# Altium project SR-BMS-Master-Ver1-RevB_stm32f105.PrjPcb
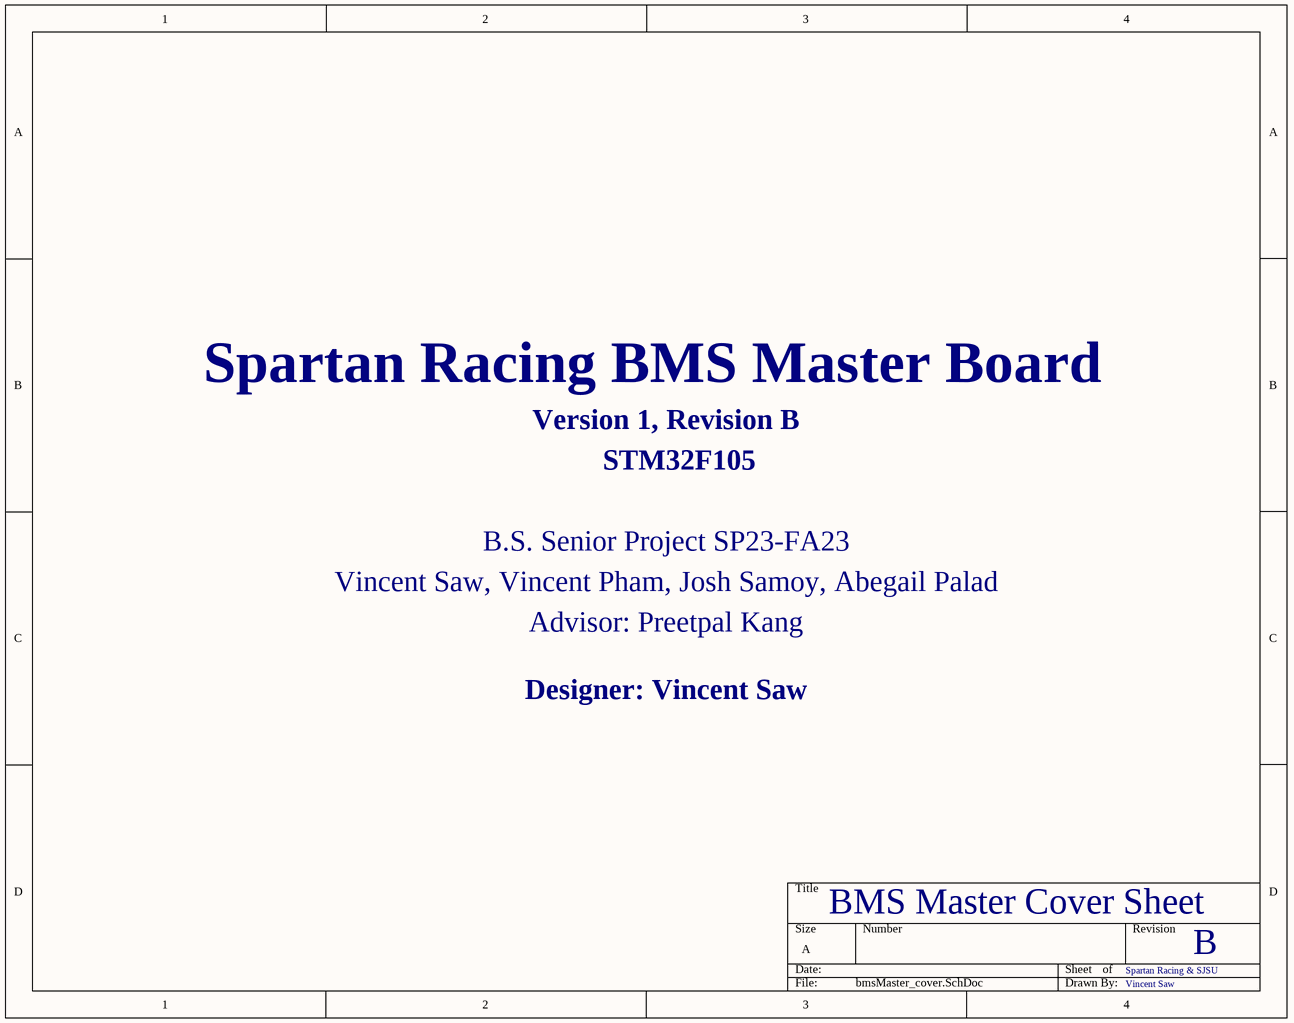
[diagram p0: bmsMaster_cover.SchDoc]
9 sheets, 220 parts. Net scope: global (net labels, ports and power ports of the same name join across sheets).
Board file: bmsMaster.PcbDoc
Sheets:
  bmsMaster_cover.SchDoc
  bmsMaster_main.SchDoc
  bmsMaster_conn.SchDoc
  bmsMaster_lvpower.SchDoc
  bmsMaster_hvpath.SchDoc
  bmsMaster_usb.SchDoc
  bmsMaster_isospi.SchDoc
  bmsMaster_can.SchDoc
  bmsMaster_led.SchDoc

## Sheet bmsMaster_cover.SchDoc
size A; SheetNumber: 1; SheetTotal: 9

### Notes on the sheet
- Spartan Racing BMS Master Board
- Version 1, Revision B
- STM32F105
- B.S. Senior Project SP23-FA23
- Vincent Saw, Vincent Pham, Josh Samoy, Abegail Palad
- Advisor: Preetpal Kang
- Designer: Vincent Saw
- BMS Master Cover Sheet
- Spartan Racing & SJSU
- B
- Vincent Saw

## Sheet bmsMaster_main.SchDoc
size B; SheetNumber: 2; SheetTotal: 9
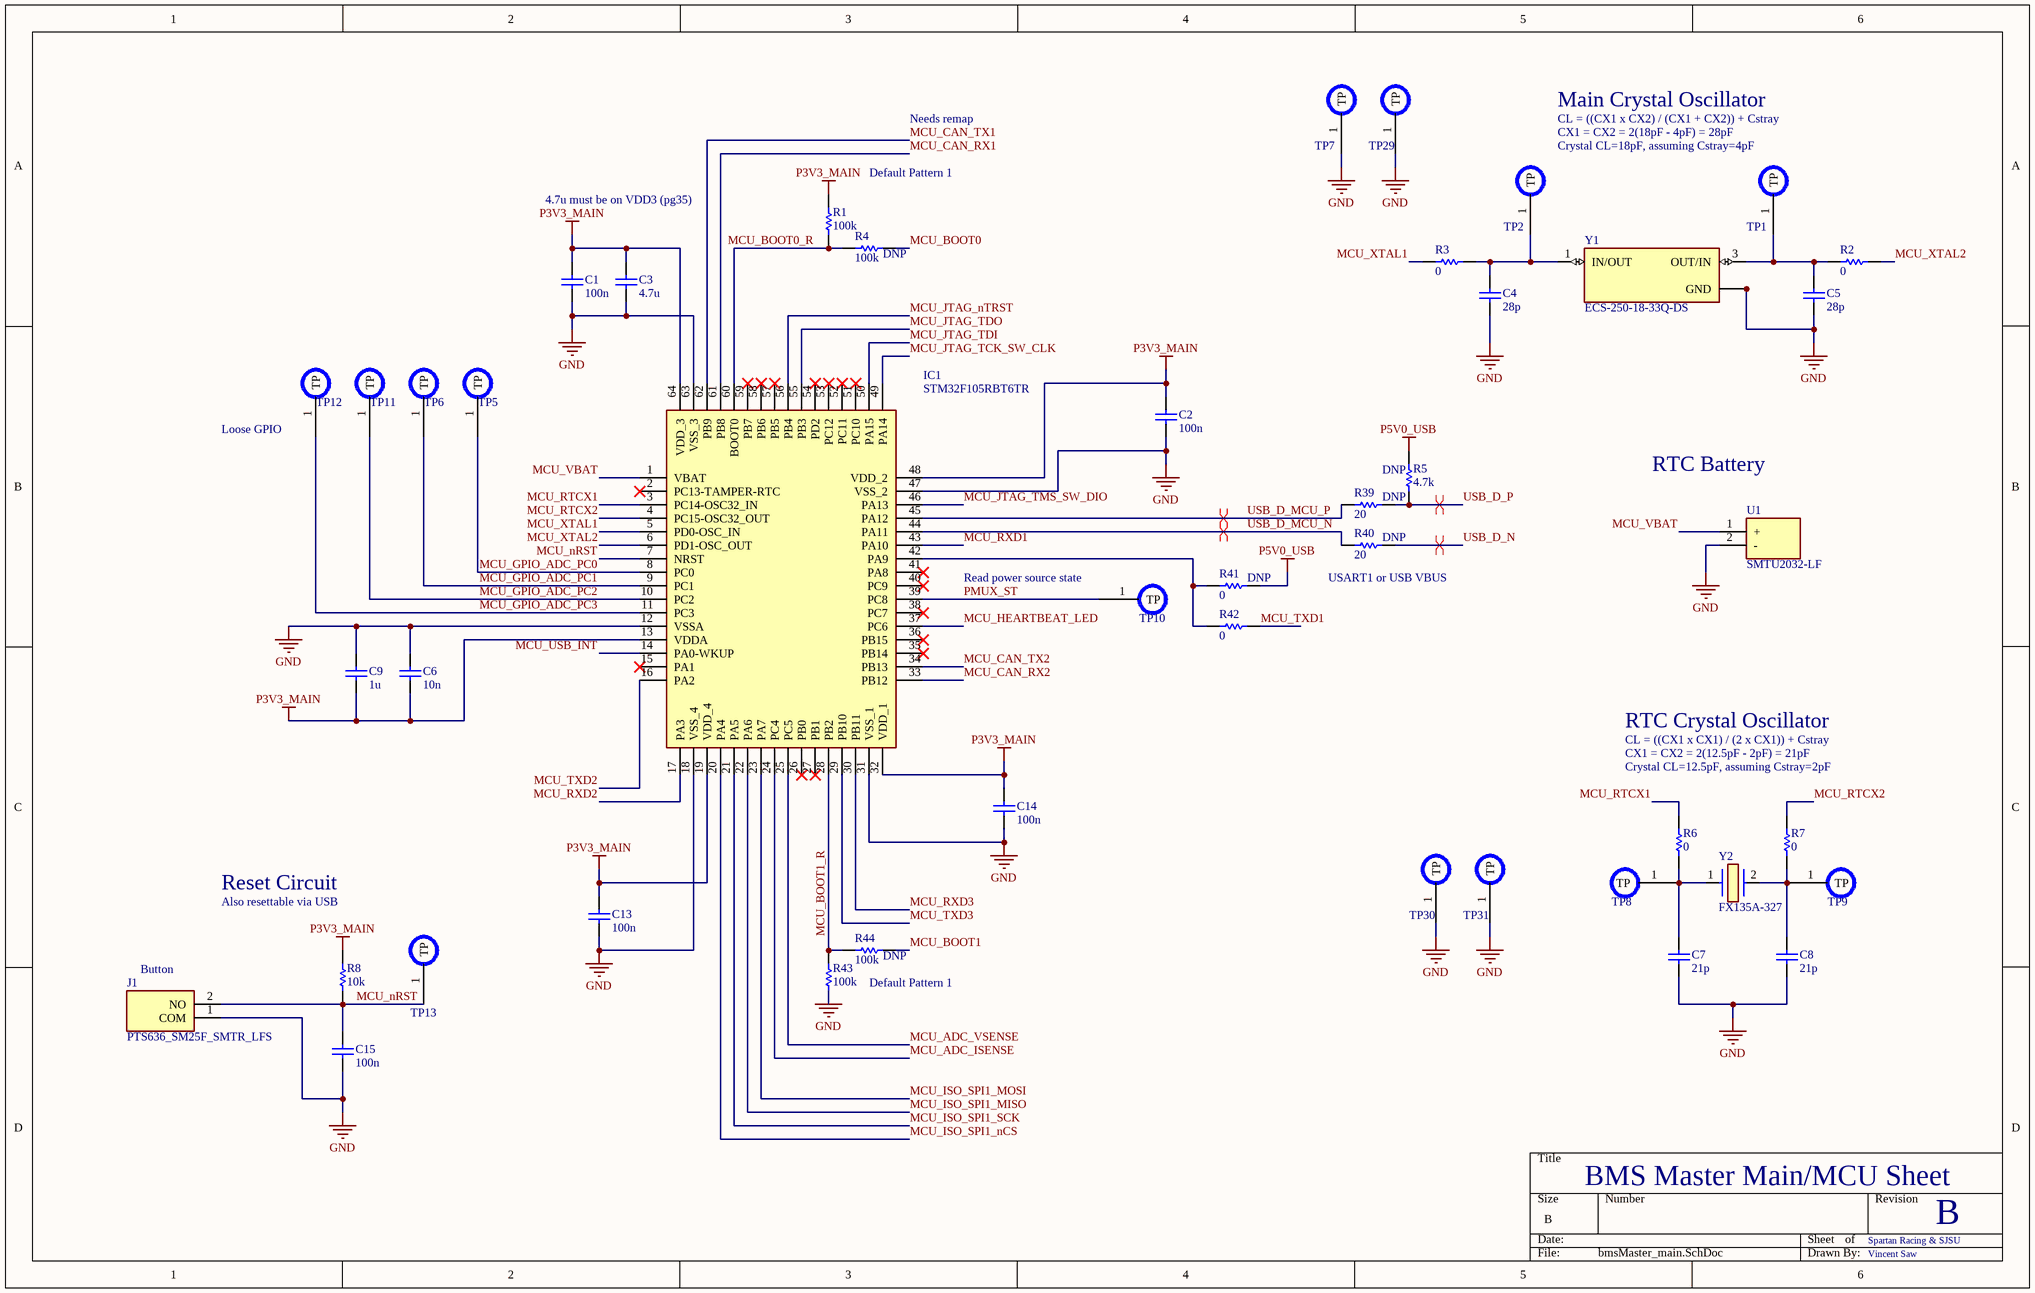
[diagram p1: bmsMaster_main.SchDoc]

### Parts
C1  value 100n  [CAPC1608X90N]  (hidden comment: Capacitor)
C2  value 100n  [CAPC1608X90N]  (hidden comment: Capacitor)
C3  value 4.7u  [CAPC1608X90N]  (hidden comment: Capacitor)
C4  value 28p  [CAPC1608X90N]  (hidden comment: Capacitor)
C5  value 28p  [CAPC1608X90N]  (hidden comment: Capacitor)
C6  value 10n  [CAPC1608X90N]  (hidden comment: Capacitor)
C7  value 21p  [CAPC1608X90N]  (hidden comment: Capacitor)
C8  value 21p  [CAPC1608X90N]  (hidden comment: Capacitor)
C9  value 1u  [CAPC1608X90N]  (hidden comment: Capacitor)
C13  value 100n  [CAPC1608X90N]  (hidden comment: Capacitor)
C14  value 100n  [CAPC1608X90N]  (hidden comment: Capacitor)
C15  value 100n  [CAPC1608X90N]  (hidden comment: Capacitor)
IC1  STM32F105RBT6TR  [QFP50P1200X1200X160-64N]
J1  PTS636_SM25F_SMTR_LFS  [PTS636SM25FSMTRLFS]
R1  value 100k  [RESC1608X50N]  (hidden comment: Resistor)
R2  value 0  [RESC1608X50N]  (hidden comment: Resistor)
R3  value 0  [RESC1608X50N]  (hidden comment: Resistor)
R4  value 100k  [RESC1608X50N]  (hidden comment: Resistor)
R5  value 4.7k  [RESC1608X50N]  (hidden comment: Resistor)
R6  value 0  [RESC1608X50N]  (hidden comment: Resistor)
R7  value 0  [RESC1608X50N]  (hidden comment: Resistor)
R8  value 10k  [RESC1608X50N]  (hidden comment: Resistor)
R39  value 20  [RESC1608X50N]  (hidden comment: Resistor)
R40  value 20  [RESC1608X50N]  (hidden comment: Resistor)
R41  value 0  [RESC1608X50N]  (hidden comment: Resistor)
R42  value 0  [RESC1608X50N]  (hidden comment: Resistor)
R43  value 100k  [RESC1608X50N]  (hidden comment: Resistor)
R44  value 100k  [RESC1608X50N]  (hidden comment: Resistor)
TP1  TSTPT  [Testpoint1]  (value not drawn)  (no BOM)
TP2  TSTPT  [Testpoint1]  (value not drawn)  (no BOM)
TP5  TSTPT  [Testpoint1]  (value not drawn)  (no BOM)
TP6  TSTPT  [Testpoint1]  (value not drawn)  (no BOM)
TP7  TSTPT  [Testpoint1]  (value not drawn)  (no BOM)
TP8  TSTPT  [Testpoint1]  (value not drawn)  (no BOM)
TP9  TSTPT  [Testpoint1]  (value not drawn)  (no BOM)
TP10  TSTPT  [Testpoint1]  (value not drawn)  (no BOM)
TP11  TSTPT  [Testpoint1]  (value not drawn)  (no BOM)
TP12  TSTPT  [Testpoint1]  (value not drawn)  (no BOM)
TP13  TSTPT  [Testpoint1]  (value not drawn)  (no BOM)
TP29  TSTPT  [Testpoint1]  (value not drawn)  (no BOM)
TP30  TSTPT  [Testpoint1]  (value not drawn)  (no BOM)
TP31  TSTPT  [Testpoint1]  (value not drawn)  (no BOM)
U1  SMTU2032-LF  [SMTU2032LF]
Y1  ECS-250-18-33Q-DS  [XTAL_ECS-250-18-33Q-DS]
Y2  FX135A-327  [FX135A327]

### Nets
GND: C1.1 C2.1 C3.1 C4.1 C5.1 C6.2 C7.1 C8.1 C9.2 C13.1 C14.1 C15.1 IC1.12(VSSA) IC1.18(VSS_4) IC1.31(VSS_1) IC1.47(VSS_2) IC1.63(VSS_3) J1.1(COM) R43.2 TP7.1(TP) TP29.1(TP) TP30.1(TP) TP31.1(TP) U1.2(-) Y1.2(GND) Y1.4(GND)
P3V3_MAIN: C1.2 C2.2 C3.2 C6.1 C9.1 C13.2 C14.2 IC1.13(VDDA) IC1.19(VDD_4) IC1.32(VDD_1) IC1.48(VDD_2) IC1.64(VDD_3) R1.2 R8.2
P5V0_USB: R5.2 R41.2
MCU_ADC_ISENSE: IC1.24(PC4)
MCU_ADC_VSENSE: IC1.25(PC5)
MCU_BOOT0: R4.2
MCU_BOOT0_R: IC1.60(BOOT0) R1.1 R4.1
MCU_BOOT1: R44.1
MCU_BOOT1_R: IC1.28(PB2) R43.1 R44.2
MCU_CAN_RX1: IC1.61(PB8)
MCU_CAN_RX2: IC1.33(PB12)
MCU_CAN_TX1: IC1.62(PB9)
MCU_CAN_TX2: IC1.34(PB13)
MCU_GPIO_ADC_PC0: IC1.8(PC0) TP5.1(TP)
MCU_GPIO_ADC_PC1: IC1.9(PC1) TP6.1(TP)
MCU_GPIO_ADC_PC2: IC1.10(PC2) TP11.1(TP)
MCU_GPIO_ADC_PC3: IC1.11(PC3) TP12.1(TP)
MCU_HEARTBEAT_LED: IC1.37(PC6)
MCU_ISO_SPI1_MISO: IC1.22(PA6)
MCU_ISO_SPI1_MOSI: IC1.23(PA7)
MCU_ISO_SPI1_nCS: IC1.20(PA4)
MCU_ISO_SPI1_SCK: IC1.21(PA5)
MCU_JTAG_nTRST: IC1.56(PB4)
MCU_JTAG_TCK_SW_CLK: IC1.49(PA14)
MCU_JTAG_TDI: IC1.50(PA15)
MCU_JTAG_TDO: IC1.55(PB3)
MCU_JTAG_TMS_SW_DIO: IC1.46(PA13)
MCU_nRST: C15.2 IC1.7(NRST) J1.2(NO) R8.1 TP13.1(TP)
MCU_RTCX1: IC1.3(PC14-OSC32_IN) R6.1
MCU_RTCX2: IC1.4(PC15-OSC32_OUT) R7.1
MCU_RXD1: IC1.43(PA10)
MCU_RXD2: IC1.17(PA3)
MCU_RXD3: IC1.30(PB11)
MCU_TXD1: R42.2
MCU_TXD2: IC1.16(PA2)
MCU_TXD3: IC1.29(PB10)
MCU_USB_INT: IC1.14(PA0-WKUP)
MCU_VBAT: IC1.1(VBAT) U1.1(+)
MCU_XTAL1: IC1.5(PD0-OSC_IN) R3.2
MCU_XTAL2: IC1.6(PD1-OSC_OUT) R2.1
PMUX_ST: IC1.39(PC8) TP10.1(TP)
USB_D_MCU_N: IC1.44(PA11) R40.1
USB_D_MCU_P: IC1.45(PA12) R39.1
USB_D_N: R40.2
USB_D_P: R5.1 R39.2
NetC4_2: C4.2 R3.1 TP2.1(TP) Y1.1(IN/OUT)
NetC5_2: C5.2 R2.2 TP1.1(TP) Y1.3(OUT/IN)
NetC7_2: C7.2 R6.2 TP8.1(TP) Y2.1
NetC8_2: C8.2 R7.2 TP9.1(TP) Y2.2
NetIC1_42: IC1.42(PA9) R41.1 R42.1

Not connected (* = marked no-connect by the designer): IC1 2(PC13-TAMPER-RTC)* 15(PA1)* 26(PB0)* 27(PB1)* 35(PB14)* 36(PB15)* 38(PC7)* 40(PC9)* 41(PA8)* 51(PC10)* 52(PC11)* 53(PC12)* 54(PD2)* 57(PB5)* 58(PB6)* 59(PB7)*

### Layout directives
differential pair: USB_D_MCU_N, USB_D_MCU_P, USB_D_N, USB_D_P

### Notes on the sheet
- Needs remap
- Main Crystal Oscillator
- CL = ((CX1 x CX2) / (CX1 + CX2)) + Cstray
- CX1 = CX2 = 2(18pF - 4pF) = 28pF
- Crystal CL=18pF, assuming Cstray=4pF
- 4.7u must be on VDD3 (pg35)
- Default Pattern 1
- (near R4) DNP
- (near TP12) Loose GPIO
- (near R39) DNP
- (near R5) DNP
- RTC Battery
- (near R40) DNP
- (near TP10) Read power source state
- (near R41) DNP
- (near R40) USART1 or USB VBUS
- RTC Crystal Oscillator
- CL = ((CX1 x CX1) / (2 x CX1)) + Cstray
- CX1 = CX2 = 2(12.5pF - 2pF) = 21pF
- Crystal CL=12.5pF, assuming Cstray=2pF
- Reset Circuit
- Also resettable via USB
- (near J1) Button
- (near R44) DNP
- BMS Master Main/MCU Sheet
- Spartan Racing & SJSU
- B
- Vincent Saw

### Library data of the parts
C1-C9 C13-C15 = Capacitor: SimulationGenericComponent: True
IC1 = STM32F105RBT6TR: Integrated Circuit; Manufacturer_Name: STMicroelectronics; Datasheet Link: http://www.st.com/content/ccc/resource/technical/document/datasheet/e4/f3/1a/89/5a/02/46/ae/CD00220364.pdf/files/CD00220364.pdf/jcr:content/translations/en.CD00220364.pdf; Height: 1.6mm; Manufacturer_Part_Number: STM32F105RBT6TR; Mouser Part Number: 511-STM32F105RBT6TR; Mouser Price/Stock: https://www.mouser.co.uk/ProductDetail/STMicroelectronics/STM32F105RBT6TR?qs=mxm%2FV7p14IMAWwOT6UWhYg%3D%3D; Arrow Part Number: STM32F105RBT6TR; Arrow Price/Stock: https://www.arrow.com/en/products/stm32f105rbt6tr/stmicroelectronics
J1 = PTS636_SM25F_SMTR_LFS: Connector; Manufacturer_Name: C & K COMPONENTS; Manufacturer_Part_Number: PTS636 SM25F SMTR LFS; Datasheet Link: https://ms.componentsearchengine.com/Datasheets/1/PTS636 SM25F SMTR LFS.pdf; Height: 2.7mm; Mouser Part Number: 611-PTS636SM25FSMTRL; Mouser Price/Stock: https://www.mouser.co.uk/ProductDetail/CK/PTS636-SM25F-SMTR-LFS?qs=vLWxofP3U2wcBTQSwfMFOw%3D%3D; Arrow Part Number: PTS636 SM25F SMTR LFS; Arrow Price/Stock: https://www.arrow.com/en/products/pts636-sm25f-smtr-lfs/ck
R1 R4 R5 R8 R39 R40 R43 R44 = Resistor: TC1: 0; SimulationGenericComponent: True; TC2: 0
R2 R3 R6 R7 R41 R42 = Resistor: SimulationGenericComponent: True; TC1: 0; TC2: 0
TP1 TP2 TP5-TP13 TP29-TP31 = Testpoint1
U1 = SMTU2032-LF: Undefined or Miscellaneous; Manufacturer_Name: RENATA; Datasheet Link: https://componentsearchengine.com/Datasheets/1/SMTU2032-LF.pdf; Height: 5mm; Manufacturer_Part_Number: SMTU2032-LF; Mouser Part Number: 614-SMTU2032-LF; Mouser Price/Stock: https://www.mouser.co.uk/ProductDetail/Renata/SMTU2032-LF?qs=r1PAtlylphCLeXbokB9Tog%3D%3D
Y1 = ECS-250-18-33Q-DS: MF: {'manufacturer': u'ECS Inc.'}; Package: None; Price: None; Value: *; MP: ECS-250-18-33Q-DS; Availability: Unavailable
Y2 = FX135A-327: Crystal or Oscillator; Manufacturer_Name: Fox; Datasheet Link: https://componentsearchengine.com/Datasheets/2/FX135A-327.pdf; Height: 0.9mm; Manufacturer_Part_Number: FX135A-327; Mouser Part Number: 559-FX135A-327; Mouser Price/Stock: https://www.mouser.co.uk/ProductDetail/Fox-Abracon/FX135A-327?qs=n5MbhIql%252BRlKJidsig7mKQ%3D%3D

## Sheet bmsMaster_conn.SchDoc
size A; SheetNumber: 3; SheetTotal: 9
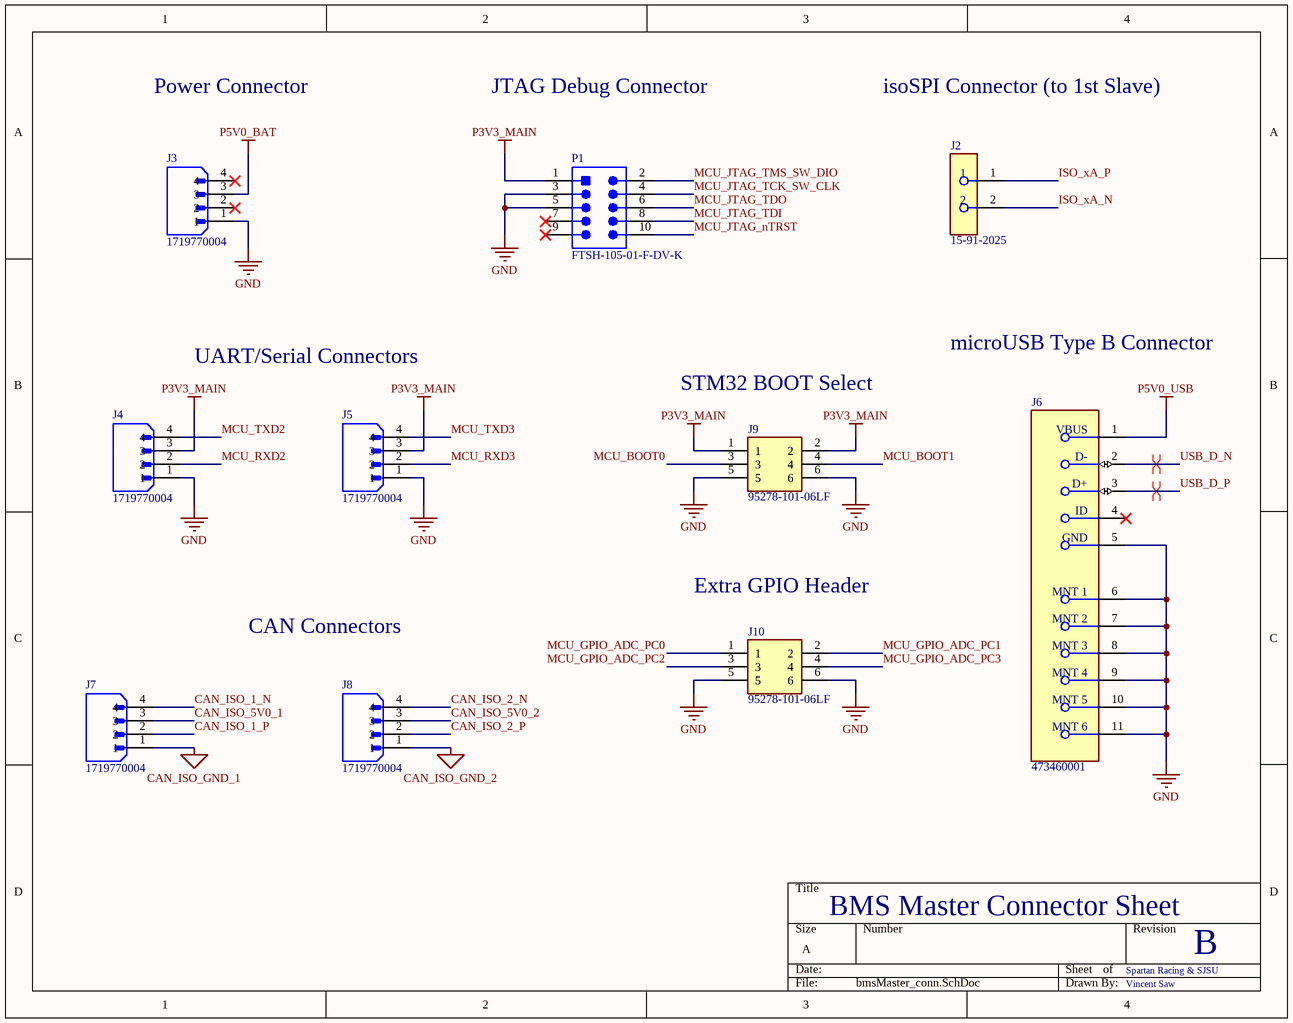
[diagram p2: bmsMaster_conn.SchDoc]

### Parts
J2  15-91-2025  [FP-15-91-2025-MFG]
J3  1719770004  [MOLEX_1719770004]
J4  1719770004  [MOLEX_1719770004]
J5  1719770004  [MOLEX_1719770004]
J6  473460001  [FP-473460001-MFG]
J7  1719770004  [MOLEX_1719770004]
J8  1719770004  [MOLEX_1719770004]
J9  95278-101-06LF  [9527810106LF]
J10  95278-101-06LF  [9527810106LF]
P1  FTSH-105-01-F-DV-K  [SMTC-FTSH-105-01-L-DV-K_V]

### Nets
CAN_ISO_5V0_1: J7.3
CAN_ISO_5V0_2: J8.3
CAN_ISO_GND_1: J7.1
CAN_ISO_GND_2: J8.1
GND: J3.1 J4.1 J5.1 J6.5(GND) J6.6(MNT_1) J6.7(MNT_2) J6.8(MNT_3) J6.9(MNT_4) J6.10(MNT_5) J6.11(MNT_6) J9.5 J9.6 J10.5 J10.6 P1.3 P1.5
P3V3_MAIN: J4.3 J5.3 J9.1 J9.2 P1.1
P5V0_BAT: J3.3
P5V0_USB: J6.1(VBUS)
CAN_ISO_1_N: J7.4
CAN_ISO_1_P: J7.2
CAN_ISO_2_N: J8.4
CAN_ISO_2_P: J8.2
ISO_xA_N: J2.2
ISO_xA_P: J2.1
MCU_BOOT0: J9.3
MCU_BOOT1: J9.4
MCU_GPIO_ADC_PC0: J10.1
MCU_GPIO_ADC_PC1: J10.2
MCU_GPIO_ADC_PC2: J10.3
MCU_GPIO_ADC_PC3: J10.4
MCU_JTAG_nTRST: P1.10
MCU_JTAG_TCK_SW_CLK: P1.4
MCU_JTAG_TDI: P1.8
MCU_JTAG_TDO: P1.6
MCU_JTAG_TMS_SW_DIO: P1.2
MCU_RXD2: J4.2
MCU_RXD3: J5.2
MCU_TXD2: J4.4
MCU_TXD3: J5.4
USB_D_N: J6.2(D-)
USB_D_P: J6.3(D+)

Not connected (* = marked no-connect by the designer): J3 2* 4*; J6 4(ID)*; P1 7* 9*

### Layout directives
differential pair: USB_D_N, USB_D_P

### Notes on the sheet
- Power Connector
- JTAG Debug Connector
- isoSPI Connector (to 1st Slave)
- UART/Serial Connectors
- microUSB Type B Connector
- STM32 BOOT Select
- CAN Connectors
- Extra GPIO Header
- BMS Master Connector Sheet
- Spartan Racing & SJSU
- B
- Vincent Saw

### Library data of the parts
J2 = CMP-04776-000618-1: CONN HEADER SMD R/A 2POS 2.54MM; Number of Contacts: 2; Voltage Rating: 250V; Max Current Rating: 1.75A; Contact Resistance: 30mR; Current Rating: 3A; Insulation Resistance: 1GR; Gender: Male; Glow Wire Compliant: Non-compliant; Contact Mating Length: 0.24inch; Max Operating Temperature: 105°C; Length: 8.64mm; Color: Black; REACH SVHC: No SVHC; Depth: 13.59mm; ELV: Compliant; Material: Brass; Contact Type: Male Pin; Number of Rows: 1; Number of Positions: 2; Housing Color: Black; Pitch: 2.54mm; Housing Material: Polyester; Flammability Rating: UL94 V-0; Packaging: Rail/Tube; RoHS Compliant: Yes; Radiation Hardening: No; Min Operating Temperature: -40°C; Termination: Solder; Mount: Surface Mount; Contact Plating: Gold; Package Quantity: 1830; Height: 5.56mm; Contact Material: Bronze; Orientation: Right Angle; Number of Circuits: 2; Lead Free: Contains Lead; Voltage Rating (DC): 250V; Series: C-Grid® SL™ 70634; Contact Gender: Male
J3-J5 J7 J8 = 1719770004: 2.54mm Pitch SL Header, Single Row, Right-Angle, LCP, Shrouded, Surface Mount, with Pegs, Matte Tin (Sn) Plating, 4 Circuits, Tube; MF: {'manufacturer': u'Molex'}; Price: None; Value: *; MP: 1719770004; Package: None; Availability: Unavailable
J6 = CMP-2000-05246-2: CONN RCPT USB2.0 MICRO B SMD R/A; Manufacturer: Molex; Conn Orientation: Right Angle; Is Female: yes; Shielding: true; Pitch: 0.65mm; Number Of Contacts: 5; Voltage Rating: 30V; Current Rating: 1.8A; Device Class L2: USB Connectors; Digikey Description: CONN RCPT USB2.0 MICRO B SMD R/A; Height: 2.945mm; RoHS: TRUE; ComponentLink2Description: Datasheet; Octopart: https://octopart.com/47346-0001-molex-7164928; Automotive: No; Package: 0; Category: Conn; Device Class L1: Connectors; Usb Standard: USB 2.0; Temperature: -30°C to +85°C; Temperature Range Low: -30°C; Footprint Url: https://www.molex.com/pdm_docs/sd/473460001_sd.pdf; ComponentLink2URL: https://www.molex.com/webdocs/datasheets/pdf/en-us/0473460001_IO_CONNECTORS.pdf; Lead Free: Yes; Manufacturer Part Number: 473460001; Contact Material: Gold,Nickel; Temperature Range High: +85°C; Device Class L3: unset
J9 J10 = 95278-101-06LF: Connector; Manufacturer_Name: Amphenol Communications Solutions; Datasheet Link: https://cdn.amphenol-cs.com/media/wysiwyg/files/drawing/95278.pdf; Height: 10mm; Manufacturer_Part_Number: 95278-101-06LF; Mouser Part Number: 649-95278-101-06LF; Mouser Price/Stock: https://www.mouser.co.uk/ProductDetail/Amphenol-FCI/95278-101-06LF?qs=AwD%252BQufC0y4QEj1gyZtDug%3D%3D; Arrow Part Number: 95278-101-06LF; Arrow Price/Stock: https://www.arrow.com/en/products/95278-101-06lf/amphenol-fci?region=europe
P1 = CMP-2000-05352-1: Male Header, Pitch 1.27 mm, 2 x 5 Position, Height 6.12 mm, RoHS, Tube; Manufacturer: Samtec; Number of Positions: 10; Connector Type: Header,Shrouded; Number of Positions Loaded: All; Row Spacing: 0.050"(1.27mm); Fastening Type: -; Package Reference: FTSH-105-01-L-DV-K; Termination: Solder; Package URL: http://suddendocs.samtec.com/prints/ftsh-1xx-xx-xxx-dv-xxx-footprint.pdf; Number of Rows: 2; Contact Finish Thickness: 3µin(0.08µm); Contact Type: MalePin; Manufacturer URL: http://www.samtec.com/; Contact Mating Length: 0.120"(3.05mm); Pitch: 0.050"(1.27mm); Series: FTSH; Features: -; Contact Finish: Gold; Color: Black; Family: RectangularConnectors-Headers,MalePins; Datasheet URL: http://suddendocs.samtec.com/prints/ftsh-1xx-xx-xxx-dv-xxx-mkt.pdf; Package Description: Male Header, Pitch 1.27 mm, 2 x 5 Position, Height 5.97 mm, Tail Length 4.32 mm; Mounting Type: SurfaceMount; Datasheet Version: Rev. ET, 10/1995; Category: Connectors,Interconnects; Packaging: Tube

## Sheet bmsMaster_lvpower.SchDoc
size A; SheetNumber: 4; SheetTotal: 9
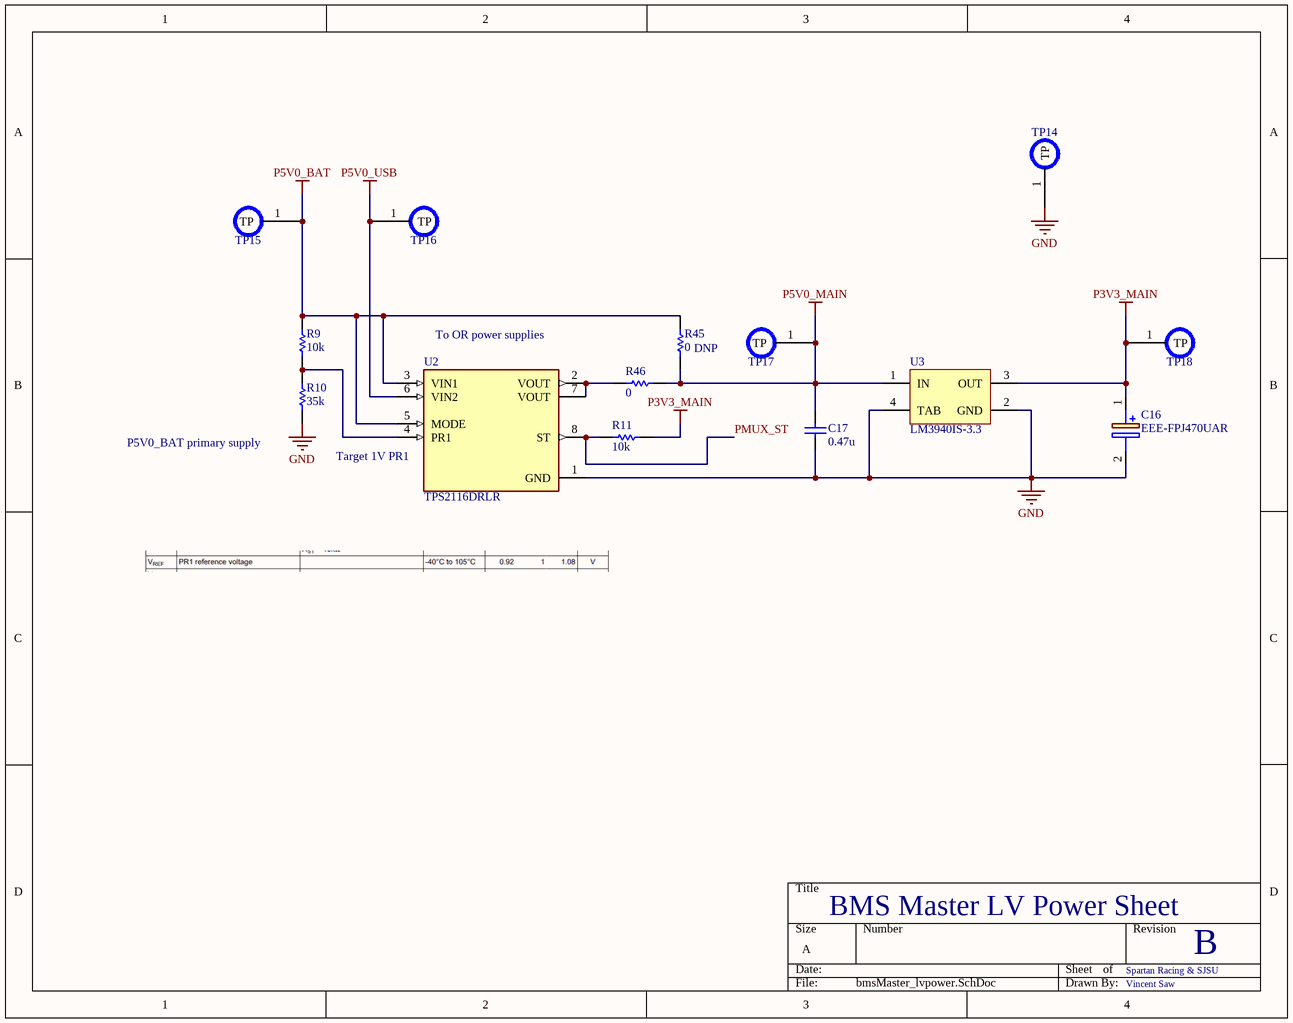
[diagram p3: bmsMaster_lvpower.SchDoc]

### Parts
C16  EEE-FPJ470UAR  [EEE1AA220WR]
C17  value 0.47u  [CAPC1608X90N]  (hidden comment: Capacitor)
R9  value 10k  [RESC1608X50N]  (hidden comment: Resistor)
R10  value 35k  [RESC1608X50N]  (hidden comment: Resistor)
R11  value 10k  [RESC1608X50N]  (hidden comment: Resistor)
R45  value 0  [RESC1608X50N]  (hidden comment: Resistor)
R46  value 0  [RESC1608X50N]  (hidden comment: Resistor)
TP14  TSTPT  [Testpoint1]  (value not drawn)  (no BOM)
TP15  TSTPT  [Testpoint1]  (value not drawn)  (no BOM)
TP16  TSTPT  [Testpoint1]  (value not drawn)  (no BOM)
TP17  TSTPT  [Testpoint1]  (value not drawn)  (no BOM)
TP18  TSTPT  [Testpoint1]  (value not drawn)  (no BOM)
U2  TPS2116DRLR  [SOTFL50P160X60-8N]
U3  LM3940IS-3.3  [KTT0003B_N]

### Nets
GND: C16.2(-) C17.1 R10.1 TP14.1(TP) U2.1(GND) U3.2(GND) U3.4(TAB)
P3V3_MAIN: C16.1(+) R11.1 TP18.1(TP) U3.3(OUT)
P5V0_BAT: R9.2 R45.2 TP15.1(TP) U2.3(VIN1) U2.5(MODE)
P5V0_MAIN: C17.2 R45.1 R46.2 TP17.1(TP) U3.1(IN)
P5V0_USB: TP16.1(TP) U2.6(VIN2)
PMUX_ST: R11.2 U2.8(ST)
NetR9_1: R9.1 R10.2 U2.4(PR1)
NetR46_1: R46.1 U2.2(VOUT) U2.7(VOUT)

### Notes on the sheet
- (near U2) To OR power supplies
- (near R45) DNP
- (near R10) P5V0_BAT primary supply
- (near U2) Target 1V PR1
- BMS Master LV Power Sheet
- Spartan Racing & SJSU
- B
- Vincent Saw

### Library data of the parts
C16 = EEE-FPJ470UAR: Capacitor Polarised; Manufacturer_Name: Panasonic; Datasheet Link: http://industrial.panasonic.com/cdbs/www-data/pdf/RDE0000/ABA0000C1184.pdf; Height: 5.5mm; Manufacturer_Part_Number: EEE-FPJ470UAR; Mouser Part Number: 667-EEE-FPJ470UAR; Mouser Price/Stock: https://www.mouser.com/Search/Refine.aspx?Keyword=667-EEE-FPJ470UAR
C17 = Capacitor: SimulationGenericComponent: True
R9-R11 = Resistor: TC1: 0; SimulationGenericComponent: True; TC2: 0
R45 R46 = Resistor: SimulationGenericComponent: True; TC1: 0; TC2: 0
TP14-TP18 = Testpoint1
U2 = TPS2116DRLR: 1.6 V to 5.5 V, 2.5-A Low IQ Power Mux with Manual and Priority Switchover; MF: {'manufacturer': u'Texas Instruments'}; Value: *; Price: None; Package: None; Availability: Unavailable; MP: TPS2116DRLR
U3 = CMP-0062-00201-4: 1A Low Dropout Regulator for 5V to 3.3V Conversion, 3-pin TO-263; Manufacturer: Texas Instruments; CompType: LDO IC; PowerWise: N; PackageTopMarking: NSUZXYTTE#*LM3940IS*-3.3 P+; PinCount: 3; Code_JEDEC: MO-169-AA; PackageReference: KTT0003B; ComponentLink1URL: http://www.ti.com/general/docs/lit/getliterature.tsp?genericPartNumber=LM3940&fileType=pdf; RoHS: N; PackageDescription: TO-263, Molded, .400 x .390 x .180in, 3 Lead, .1in Pitch, Surface Mount; ComponentLink1Description: Datasheet URL

## Sheet bmsMaster_hvpath.SchDoc
size B; SheetNumber: 5; SheetTotal: 9
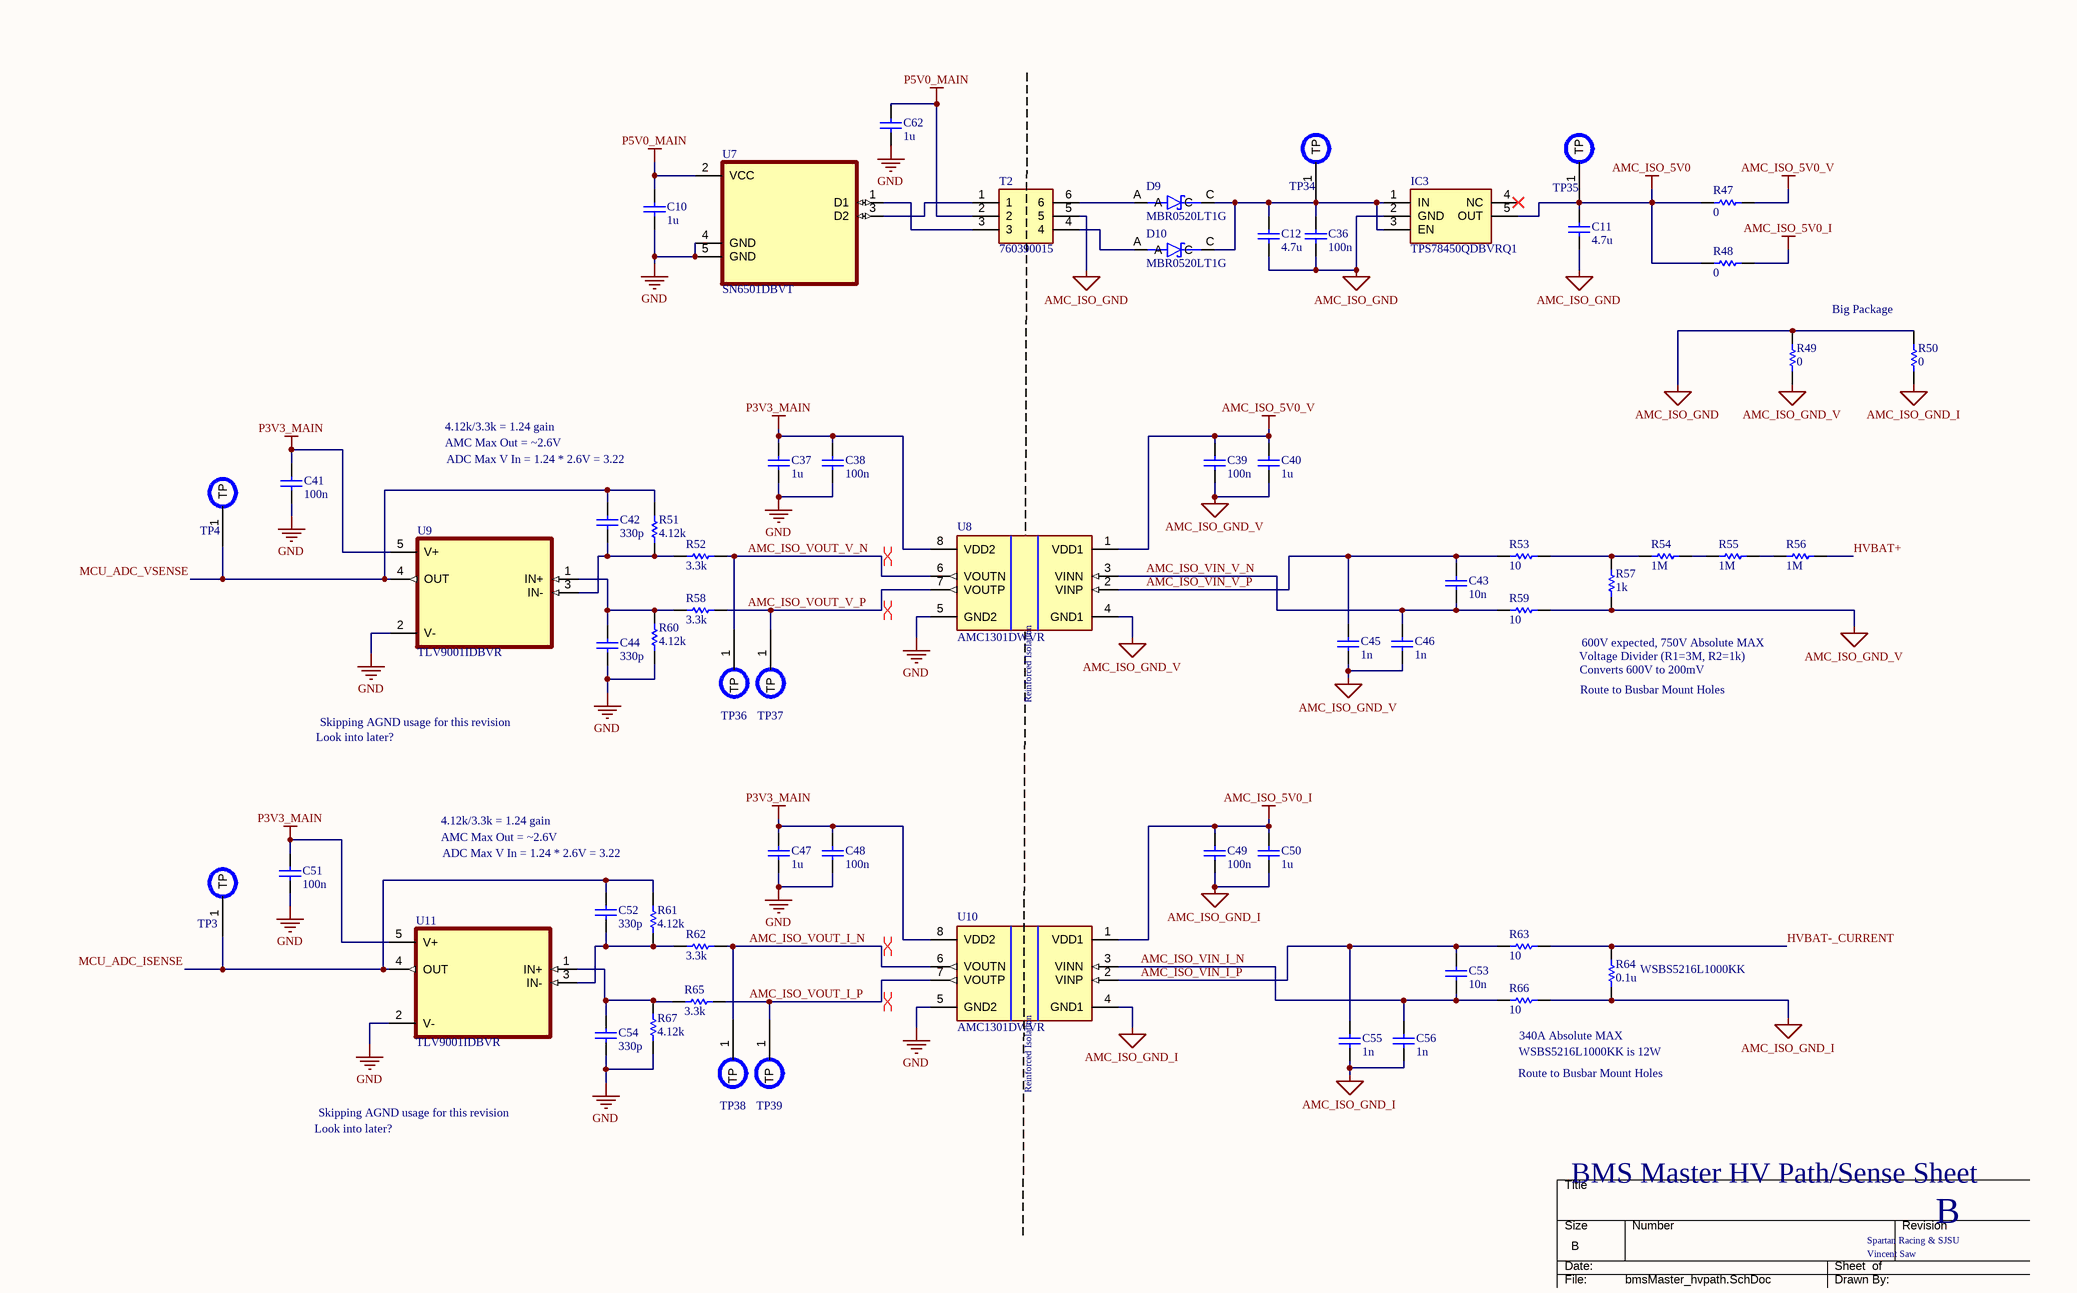
[diagram p4: bmsMaster_hvpath.SchDoc]

### Parts
C10  value 1u  [CAPC1608X90N]  (hidden comment: Capacitor)
C11  value 4.7u  [CAPC1608X90N]  (hidden comment: Capacitor)
C12  value 4.7u  [CAPC1608X90N]  (hidden comment: Capacitor)
C36  value 100n  [CAPC1608X90N]  (hidden comment: Capacitor)
C37  value 1u  [CAPC1608X90N]  (hidden comment: Capacitor)
C38  value 100n  [CAPC1608X90N]  (hidden comment: Capacitor)
C39  value 100n  [CAPC1608X90N]  (hidden comment: Capacitor)
C40  value 1u  [CAPC1608X90N]  (hidden comment: Capacitor)
C41  value 100n  [CAPC1608X90N]  (hidden comment: Capacitor)
C42  value 330p  [CAPC1608X90N]  (hidden comment: Capacitor)
C43  value 10n  [CAPC1608X90N]  (hidden comment: Capacitor)
C44  value 330p  [CAPC1608X90N]  (hidden comment: Capacitor)
C45  value 1n  [CAPC1608X90N]  (hidden comment: Capacitor)
C46  value 1n  [CAPC1608X90N]  (hidden comment: Capacitor)
C47  value 1u  [CAPC1608X90N]  (hidden comment: Capacitor)
C48  value 100n  [CAPC1608X90N]  (hidden comment: Capacitor)
C49  value 100n  [CAPC1608X90N]  (hidden comment: Capacitor)
C50  value 1u  [CAPC1608X90N]  (hidden comment: Capacitor)
C51  value 100n  [CAPC1608X90N]  (hidden comment: Capacitor)
C52  value 330p  [CAPC1608X90N]  (hidden comment: Capacitor)
C53  value 10n  [CAPC1608X90N]  (hidden comment: Capacitor)
C54  value 330p  [CAPC1608X90N]  (hidden comment: Capacitor)
C55  value 1n  [CAPC1608X90N]  (hidden comment: Capacitor)
C56  value 1n  [CAPC1608X90N]  (hidden comment: Capacitor)
C62  value 1u  [CAPC1608X90N]  (hidden comment: Capacitor)
D9  MBR0520LT1G  [SOD3716X135N]
D10  MBR0520LT1G  [SOD3716X135N]
IC3  TPS78450QDBVRQ1  [SOT95P280X145-5N]
R47  value 0  [RESC1608X50N]  (hidden comment: Resistor)
R48  value 0  [RESC1608X50N]  (hidden comment: Resistor)
R49  value 0  [RESC1608X50N]  (hidden comment: Resistor)
R50  value 0  [RESC1608X50N]  (hidden comment: Resistor)
R51  value 4.12k  [RESC1608X50N]  (hidden comment: Resistor)
R52  value 3.3k  [RESC1608X50N]  (hidden comment: Resistor)
R53  value 10  [RESC1608X50N]  (hidden comment: Resistor)
R54  value 1M  [RESC1608X50N]  (hidden comment: Resistor)
R55  value 1M  [RESC1608X50N]  (hidden comment: Resistor)
R56  value 1M  [RESC1608X50N]  (hidden comment: Resistor)
R57  value 1k  [RESC1608X50N]  (hidden comment: Resistor)
R58  value 3.3k  [RESC1608X50N]  (hidden comment: Resistor)
R59  value 10  [RESC1608X50N]  (hidden comment: Resistor)
R60  value 4.12k  [RESC1608X50N]  (hidden comment: Resistor)
R61  value 4.12k  [RESC1608X50N]  (hidden comment: Resistor)
R62  value 3.3k  [RESC1608X50N]  (hidden comment: Resistor)
R63  value 10  [RESC1608X50N]  (hidden comment: Resistor)
R64  WSBS5216L1000KK  value 0.1u  [RESC1608X50N]
R65  value 3.3k  [RESC1608X50N]  (hidden comment: Resistor)
R66  value 10  [RESC1608X50N]  (hidden comment: Resistor)
R67  value 4.12k  [RESC1608X50N]  (hidden comment: Resistor)
T2  760390015  [760390015]
TP3  TSTPT  [Testpoint1]  (value not drawn)  (no BOM)
TP4  TSTPT  [Testpoint1]  (value not drawn)  (no BOM)
TP34  TSTPT  [Testpoint1]  (value not drawn)  (no BOM)
TP35  TSTPT  [Testpoint1]  (value not drawn)  (no BOM)
TP36  TSTPT  [Testpoint1]  (value not drawn)  (no BOM)
TP37  TSTPT  [Testpoint1]  (value not drawn)  (no BOM)
TP38  TSTPT  [Testpoint1]  (value not drawn)  (no BOM)
TP39  TSTPT  [Testpoint1]  (value not drawn)  (no BOM)
U7  SN6501DBVT  [SOT95P280X145-5N]
U8  AMC1301DWVR  [SOIC127P1150X280-8N]
U9  TLV9001IDBVR  [SOT95P280X145-5N]
U10  AMC1301DWVR  [SOIC127P1150X280-8N]
U11  TLV9001IDBVR  [SOT95P280X145-5N]

### Nets
AMC_ISO_5V0: C11.2 IC3.5(OUT) R47.1 R48.1 TP35.1(TP)
AMC_ISO_5V0_I: C49.2 C50.2 R48.2 U10.1(VDD1)
AMC_ISO_5V0_V: C39.2 C40.2 R47.2 U8.1(VDD1)
AMC_ISO_GND: C11.1 C12.1 C36.1 IC3.2(GND) R49.2 R50.2 T2.5
AMC_ISO_GND_I: C49.1 C50.1 C55.1 C56.1 R50.1 R64.1 R66.1 U10.4(GND1)
AMC_ISO_GND_V: C39.1 C40.1 C45.1 C46.1 R49.1 R57.1 R59.1 U8.4(GND1)
GND: C10.1 C37.1 C38.1 C41.1 C44.1 C47.1 C48.1 C51.1 C54.1 C62.1 R60.2 R67.2 U7.4(GND) U7.5(GND) U8.5(GND2) U9.2(V-) U10.5(GND2) U11.2(V-)
P3V3_MAIN: C37.2 C38.2 C41.2 C47.2 C48.2 C51.2 U8.8(VDD2) U9.5(V+) U10.8(VDD2) U11.5(V+)
P5V0_MAIN: C10.2 C62.2 T2.2 U7.2(VCC)
AMC_ISO_VIN_I_N: C53.1 C56.2 R66.2 U10.3(VINN)
AMC_ISO_VIN_I_P: C53.2 C55.2 R63.2 U10.2(VINP)
AMC_ISO_VIN_V_N: C43.1 C46.2 R59.2 U8.3(VINN)
AMC_ISO_VIN_V_P: C43.2 C45.2 R53.2 U8.2(VINP)
AMC_ISO_VOUT_I_N: R62.1 TP38.1(TP) U10.6(VOUTN)
AMC_ISO_VOUT_I_P: R65.1 TP39.1(TP) U10.7(VOUTP)
AMC_ISO_VOUT_V_N: R52.1 TP36.1(TP) U8.6(VOUTN)
AMC_ISO_VOUT_V_P: R58.1 TP37.1(TP) U8.7(VOUTP)
HVBAT+: R56.1
HVBAT-_CURRENT: R63.1 R64.2
MCU_ADC_ISENSE: C52.2 R61.1 TP3.1(TP) U11.4(OUT)
MCU_ADC_VSENSE: C42.2 R51.1 TP4.1(TP) U9.4(OUT)
NetC12_2: C12.2 C36.2 D9.C D10.C IC3.1(IN) IC3.3(EN) TP34.1(TP)
NetC42_1: C42.1 R51.2 R52.2 U9.3(IN-)
NetC44_2: C44.2 R58.2 R60.1 U9.1(IN+)
NetC52_1: C52.1 R61.2 R62.2 U11.3(IN-)
NetC54_2: C54.2 R65.2 R67.1 U11.1(IN+)
NetD9_A: D9.A T2.6
NetD10_A: D10.A T2.4
NetR53_1: R53.1 R54.2 R57.2
NetR54_1: R54.1 R55.2
NetR55_1: R55.1 R56.2
NetT2_1: T2.1 U7.3(D2)
NetT2_3: T2.3 U7.1(D1)

Not connected (* = marked no-connect by the designer): IC3 4(NC)*

### Layout directives
differential pair: AMC_ISO_VOUT_I_N, AMC_ISO_VOUT_I_P, AMC_ISO_VOUT_V_N, AMC_ISO_VOUT_V_P

### Notes on the sheet
- Big Package
- 4.12k/3.3k = 1.24 gain
- AMC Max Out = ~2.6V
- ADC Max V In = 1.24 * 2.6V = 3.22
- Converts 600V to 200mV
- Route to Busbar Mount Holes
- Voltage Divider (R1=3M, R2=1k)
- 600V expected, 750V Absolute MAX
- Look into later?
- Skipping AGND usage for this revision
- 340A Absolute MAX
- WSBS5216L1000KK is 12W
- BMS Master HV Path/Sense Sheet
- Spartan Racing & SJSU
- B
- Vincent Saw
- DWG. NO.
- REV.
- SHT.
- THIS DOCUMENT AND THE DATA DISCLOSED HEREIN OR HEREWITH IS THE PROPERTY OF ALTIUM LIMITED AND MAY BE FREELY DISTRIBUTED IN WHOLE. NO RIGHTS ARE RESERVED OR EXPRESS OR IMPLIED WARANTEE GIVEN.
- REVISION
- DESCRIPTION
- DATE
- APPROVED
- ENG:
- APPROVALS
- PROJECT
- DSN:
- CHK:
- REFERENCE DOCUMENTS
- PROJECT REVISION:
- TITLE
- DOCUMENT REVISION:
- DESIGN ITEM:
- BOM:
- FAB DWG:
- PCB DWG:
- ASSY DWG:
- SCALE:
- SIZE
- CAGE CODE
- FILE NAME
- DWG NO.
- SHEET
- OF
- REV
- (in symbol AMC1301DWVR) Reinforced Isolation

### Library data of the parts
C10-C12 C36-C56 C62 = Capacitor: SimulationGenericComponent: True
D9 D10 = MBR0520LT1G: Rectifier, Schottky Power; Plastic Sod-123; 0.5 a @ +90c If; +125; 20v; 1000; MF: {'manufacturer': u'ON Semiconductor'}; Package: None; Price: None; Value: *; MP: MBR0520LT1G; Availability: Unavailable
IC3 = TPS78450QDBVRQ1: Integrated Circuit; Manufacturer_Name: Texas Instruments; Datasheet Link: https://www.ti.com/lit/ds/symlink/tps784-q1.pdf?ts=1621597556803&ref_url=https%253A%252F%252Fwww.ti.com%252Fstore%252Fti%252Fen%252Fp%252Fproduct%252F%253Fp%253DTPS78401QDBVRQ1; Height: 1.45mm; Manufacturer_Part_Number: TPS78450QDBVRQ1; Mouser Part Number: 595-TPS78450QDBVRQ1; Mouser Price/Stock: https://www.mouser.co.uk/ProductDetail/Texas-Instruments/TPS78450QDBVRQ1?qs=OlC7AqGiEDlNiKKFTXJdtA%3D%3D
R47-R50 = Resistor: SimulationGenericComponent: True; TC1: 0; TC2: 0
R51-R53 R58-R67 = Resistor: TC1: 0; SimulationGenericComponent: True; TC2: 0
R54-R57 = Resistor: WSBS5216L1000KK; TC1: 0; SimulationGenericComponent: True; TC2: 0
T2 = 760390015: Transformer; Manufacturer_Name: Wurth Elektronik; Datasheet Link: https://www.we-online.com/components/products/datasheet/760390015.pdf; Manufacturer_Part_Number: 760390015; Mouser Part Number: 710-760390015; Mouser Price/Stock: https://www.mouser.co.uk/ProductDetail/Wurth-Elektronik/760390015?qs=wElim4iM2pjOQCmk%252B8YbFA%3D%3D
TP3 TP4 TP34-TP39 = Testpoint1
U7 = SN6501DBVT: MF: {'manufacturer': u'Texas Instruments'}; Package: None; Price: None; Value: *; MP: SN6501DBVT; Availability: Unavailable
U8 U10 = AMC1301DWVR: MF: {'manufacturer': u'Texas Instruments'}; Package: None; Price: None; Value: *; MP: AMC1301DWVR; Availability: Unavailable
U9 U11 = TLV9001IDBVR: MF: {'manufacturer': u'Texas Instruments'}; Package: None; Price: None; Value: *; MP: TLV9001IDBVR; Availability: Unavailable

## Sheet bmsMaster_usb.SchDoc
size A; SheetNumber: 6; SheetTotal: 9
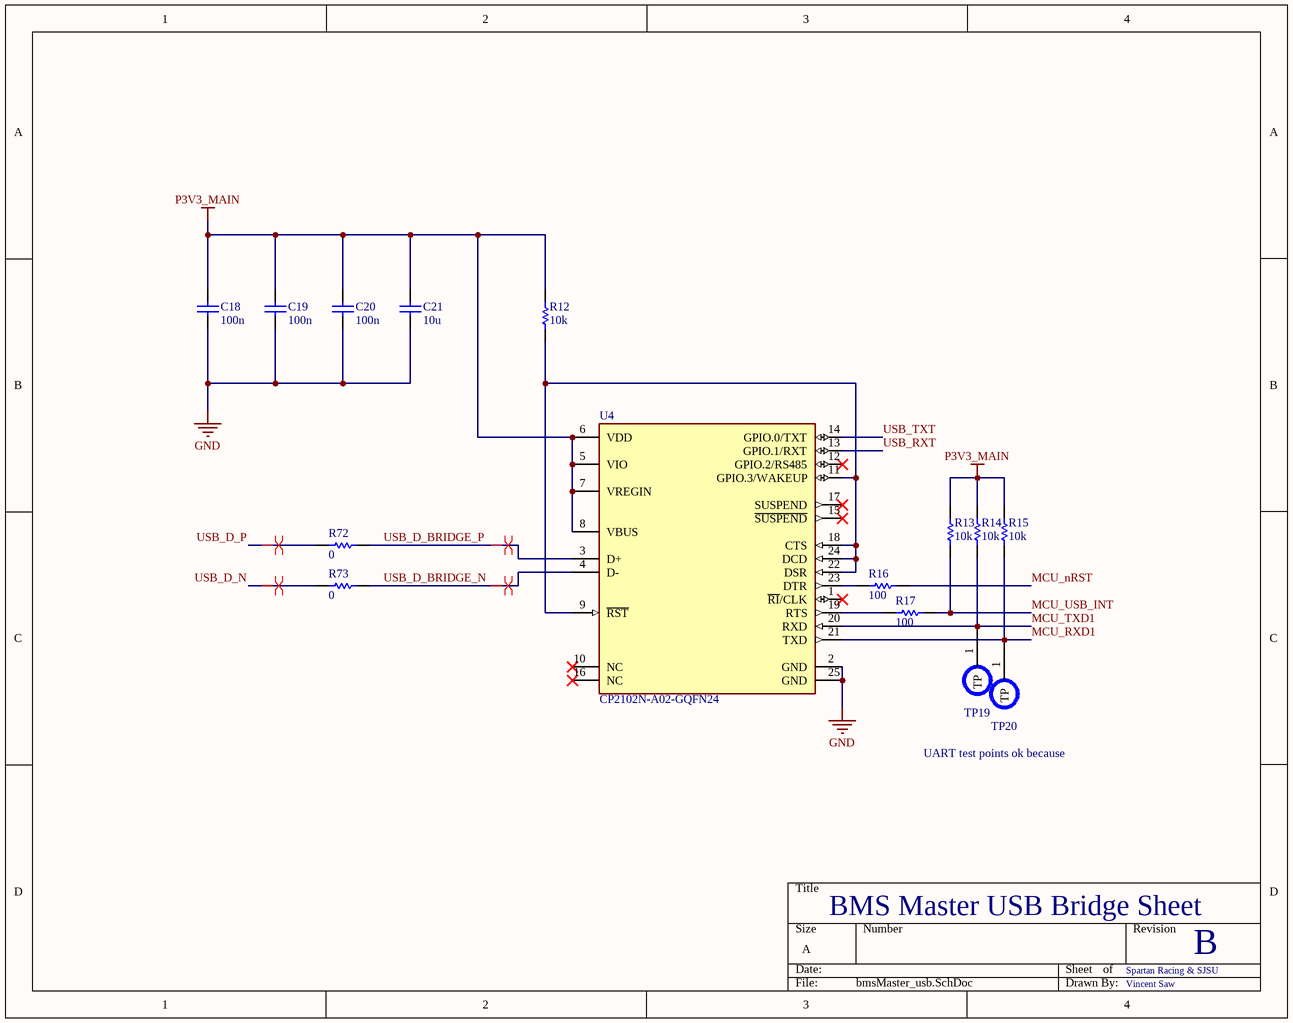
[diagram p5: bmsMaster_usb.SchDoc]

### Parts
C18  value 100n  [CAPC1608X90N]  (hidden comment: Capacitor)
C19  value 100n  [CAPC1608X90N]  (hidden comment: Capacitor)
C20  value 100n  [CAPC1608X90N]  (hidden comment: Capacitor)
C21  value 10u  [CAPC1608X90N]  (hidden comment: Capacitor)
R12  value 10k  [RESC1608X50N]  (hidden comment: Resistor)
R13  value 10k  [RESC1608X50N]  (hidden comment: Resistor)
R14  value 10k  [RESC1608X50N]  (hidden comment: Resistor)
R15  value 10k  [RESC1608X50N]  (hidden comment: Resistor)
R16  value 100  [RESC1608X50N]  (hidden comment: Resistor)
R17  value 100  [RESC1608X50N]  (hidden comment: Resistor)
R72  value 0  [RESC1608X50N]  (hidden comment: Resistor)
R73  value 0  [RESC1608X50N]  (hidden comment: Resistor)
TP19  TSTPT  [Testpoint1]  (value not drawn)  (no BOM)
TP20  TSTPT  [Testpoint1]  (value not drawn)  (no BOM)
U4  CP2102N-A02-GQFN24  [FP-CP2102N-A02-GQFN24-MFG]

### Nets
GND: C18.1 C19.1 C20.1 C21.1 U4.2(GND) U4.25(GND)
P3V3_MAIN: C18.2 C19.2 C20.2 C21.2 R12.2 R13.2 R14.2 R15.2 U4.5(VIO) U4.6(VDD) U4.7(VREGIN) U4.8(VBUS)
MCU_nRST: R16.1
MCU_RXD1: R15.1 TP20.1(TP) U4.21(TXD)
MCU_TXD1: R14.1 TP19.1(TP) U4.20(RXD)
MCU_USB_INT: R13.1 R17.1
USB_D_BRIDGE_N: R73.2 U4.4(D-)
USB_D_BRIDGE_P: R72.2 U4.3(D+)
USB_D_N: R73.1
USB_D_P: R72.1
USB_RXT: U4.13(GPIO.1/RXT)
USB_TXT: U4.14(GPIO.0/TXT)
NetR12_1: R12.1 U4.9(~{RST}) U4.11(GPIO.3/WAKEUP) U4.18(CTS) U4.22(DSR) U4.24(DCD)
NetR16_2: R16.2 U4.23(DTR)
NetR17_2: R17.2 U4.19(RTS)

Not connected (* = marked no-connect by the designer): U4 1(~{RI}/CLK)* 10(NC)* 12(GPIO.2/RS485)* 15(~{SUSPEND})* 16(NC)* 17(SUSPEND)*

### Layout directives
differential pair: USB_D_BRIDGE_N, USB_D_BRIDGE_P, USB_D_N, USB_D_P

### Notes on the sheet
- UART test points ok because
- BMS Master USB Bridge Sheet
- Spartan Racing & SJSU
- B
- Vincent Saw

### Library data of the parts
C18-C21 = Capacitor: SimulationGenericComponent: True
R12-R17 = Resistor: TC1: 0; SimulationGenericComponent: True; TC2: 0
R72 R73 = Resistor: SimulationGenericComponent: True; TC1: 0; TC2: 0
TP19 TP20 = Testpoint1
U4 = CMP-08107-000010-1: IC USB TO UART BRIDGE QFN24

## Sheet bmsMaster_isospi.SchDoc
size A; SheetNumber: 7; SheetTotal: 9
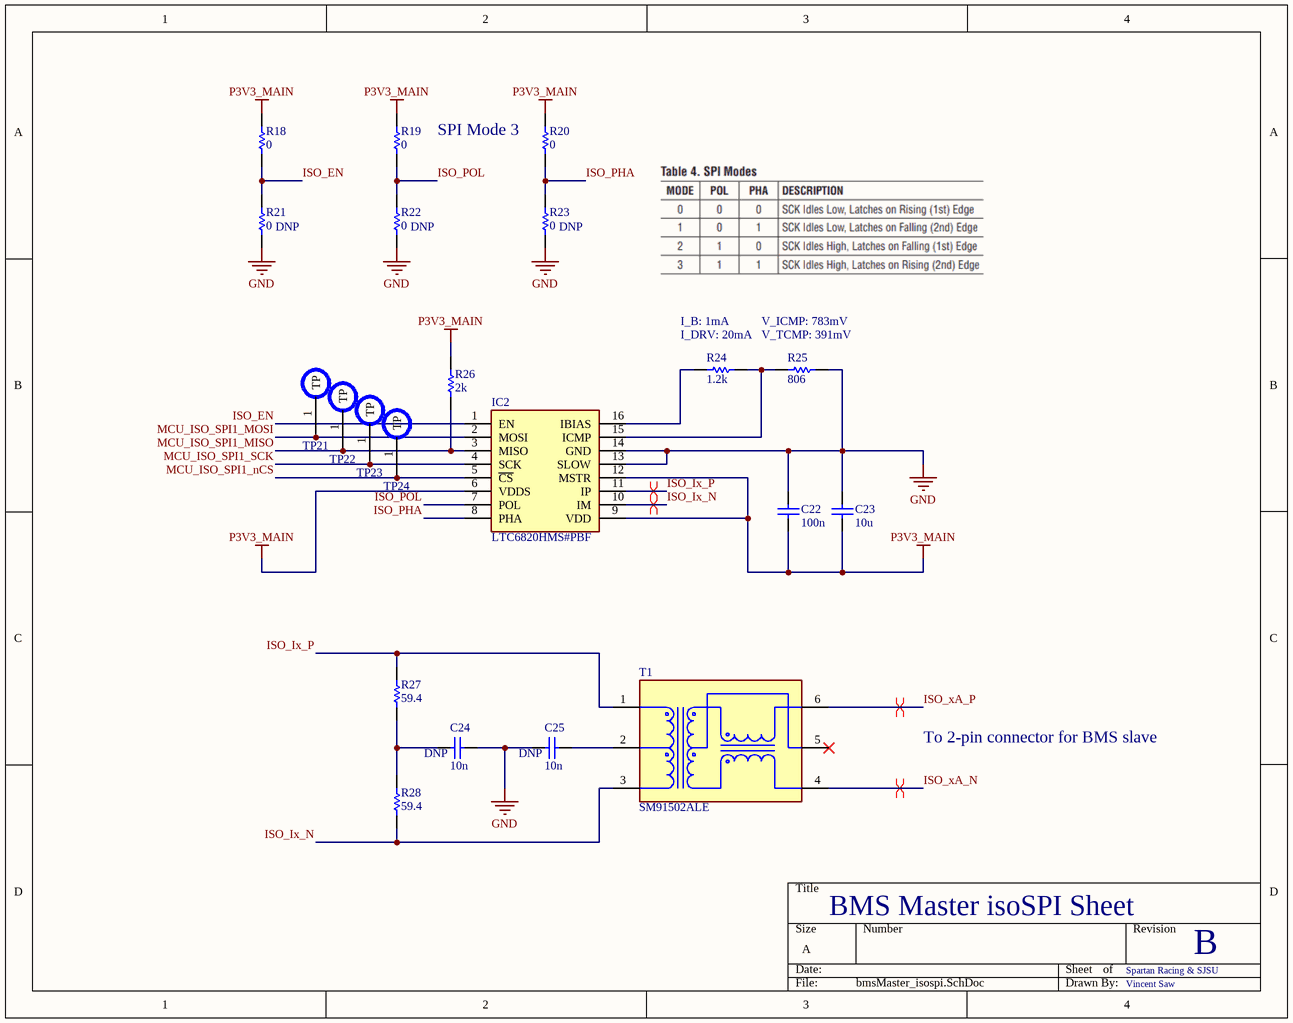
[diagram p6: bmsMaster_isospi.SchDoc]

### Parts
C22  value 100n  [CAPC1608X90N]  (hidden comment: Capacitor)
C23  value 10u  [CAPC1608X90N]  (hidden comment: Capacitor)
C24  value 10n  [CAPC1608X90N]  (hidden comment: Capacitor)
C25  value 10n  [CAPC1608X90N]  (hidden comment: Capacitor)
IC2  LTC6820HMS#PBF  [SOP50P490X110-16N]
R18  value 0  [RESC1608X50N]  (hidden comment: Resistor)
R19  value 0  [RESC1608X50N]  (hidden comment: Resistor)
R20  value 0  [RESC1608X50N]  (hidden comment: Resistor)
R21  value 0  [RESC1608X50N]  (hidden comment: Resistor)
R22  value 0  [RESC1608X50N]  (hidden comment: Resistor)
R23  value 0  [RESC1608X50N]  (hidden comment: Resistor)
R24  value 1.2k  [RESC1608X50N]  (hidden comment: Resistor)
R25  value 806  [RESC1608X50N]  (hidden comment: Resistor)
R26  value 2k  [RESC1608X50N]  (hidden comment: Resistor)
R27  value 59.4  [RESC1608X50N]  (hidden comment: Resistor)
R28  value 59.4  [RESC1608X50N]  (hidden comment: Resistor)
T1  SM91502ALE  [FP-SM91502ALE-MFG]
TP21  TSTPT  [Testpoint1]  (value not drawn)  (no BOM)
TP22  TSTPT  [Testpoint1]  (value not drawn)  (no BOM)
TP23  TSTPT  [Testpoint1]  (value not drawn)  (no BOM)
TP24  TSTPT  [Testpoint1]  (value not drawn)  (no BOM)

### Nets
GND: C22.2 C23.2 C24.1 C25.1 IC2.13(SLOW) IC2.14(GND) R21.1 R22.1 R23.1 R25.2
P3V3_MAIN: C22.1 C23.1 IC2.6(VDDS) IC2.9(VDD) IC2.12(MSTR) R18.2 R19.2 R20.2 R26.2
ISO_EN: IC2.1(EN) R18.1 R21.2
ISO_Ix_N: IC2.10(IM) R28.1 T1.3
ISO_Ix_P: IC2.11(IP) R27.2 T1.1
ISO_PHA: IC2.8(PHA) R20.1 R23.2
ISO_POL: IC2.7(POL) R19.1 R22.2
ISO_xA_N: T1.4
ISO_xA_P: T1.6
MCU_ISO_SPI1_MISO: IC2.3(MISO) R26.1 TP22.1(TP)
MCU_ISO_SPI1_MOSI: IC2.2(MOSI) TP21.1(TP)
MCU_ISO_SPI1_nCS: IC2.5(~{CS}) TP24.1(TP)
MCU_ISO_SPI1_SCK: IC2.4(SCK) TP23.1(TP)
NetC24_2: C24.2 R27.1 R28.2
NetC25_2: C25.2 T1.2
NetIC2_15: IC2.15(ICMP) R24.2 R25.1
NetIC2_16: IC2.16(IBIAS) R24.1

Not connected (* = marked no-connect by the designer): T1 5*

### Layout directives
differential pair: ISO_Ix_N, ISO_Ix_P, ISO_xA_N, ISO_xA_P

### Notes on the sheet
- (near R20) SPI Mode 3
- (near R21) DNP
- (near R22) DNP
- (near R23) DNP
- (near R24) I_B: 1mA
- (near R24) I_DRV: 20mA
- V_ICMP: 783mV
- V_TCMP: 391mV
- (near C24) DNP
- (near C25) DNP
- To 2-pin connector for BMS slave
- BMS Master isoSPI Sheet
- Spartan Racing & SJSU
- B
- Vincent Saw

### Library data of the parts
C22-C25 = Capacitor: SimulationGenericComponent: True
IC2 = LTC6820HMS#PBF: Integrated Circuit; Manufacturer_Name: Analog Devices; Datasheet Link: https://www.analog.com/media/en/technical-documentation/data-sheets/LTC6820.pdf; Height: 1.1mm; Manufacturer_Part_Number: LTC6820HMS#PBF; Mouser Part Number: 584-LTC6820HMS#PBF; Mouser Price/Stock: https://www.mouser.co.uk/ProductDetail/Analog-Devices/LTC6820HMSPBF?qs=hVkxg5c3xu%252BAhS55eUb%252BEQ%3D%3D; Arrow Part Number: LTC6820HMS#PBF; Arrow Price/Stock: https://www.arrow.com/en/products/ltc6820hmspbf/analog-devices?region=europe
R18-R23 = Resistor: SimulationGenericComponent: True; TC1: 0; TC2: 0
R24-R28 = Resistor: TC1: 0; SimulationGenericComponent: True; TC2: 0
T1 = CMP-07264-000001-1: BMS XFORMER 1-CH 1000V AECQ +125; Manufacturer: Bourns; Standoff Height: 0.13mm; Turns Ratio: 1:1; Automotive Grade: Grade 1; Isolation Voltage: 4300VDC; Return Loss: -22dB; Insertion Loss: -0.25dB; Height: 5.72mm; Automotive: Yes; Package: 0; Device Class L3: unset; ComponentLink2Description: Datasheet; Category: Trans; ComponentLink2URL: https://www.bourns.com/docs/product-datasheets/SM91502AL.pdf; Device Class L1: Passive Components; Manufacturer Part Number: SM91502ALE; Temperature Range High: +125°C; Digikey Description: BMS XFORMER 1-CH 1000V AECQ +125; RoHS: TRUE; Lead Free: Yes; Octopart: https://octopart.com/sm91502ale-bourns-95732123; Device Class L2: Transformers; Temperature: -40°C to +125°C; Temperature Range Low: -40°C
TP21-TP24 = Testpoint1

## Sheet bmsMaster_can.SchDoc
size B; SheetNumber: 8; SheetTotal: 9
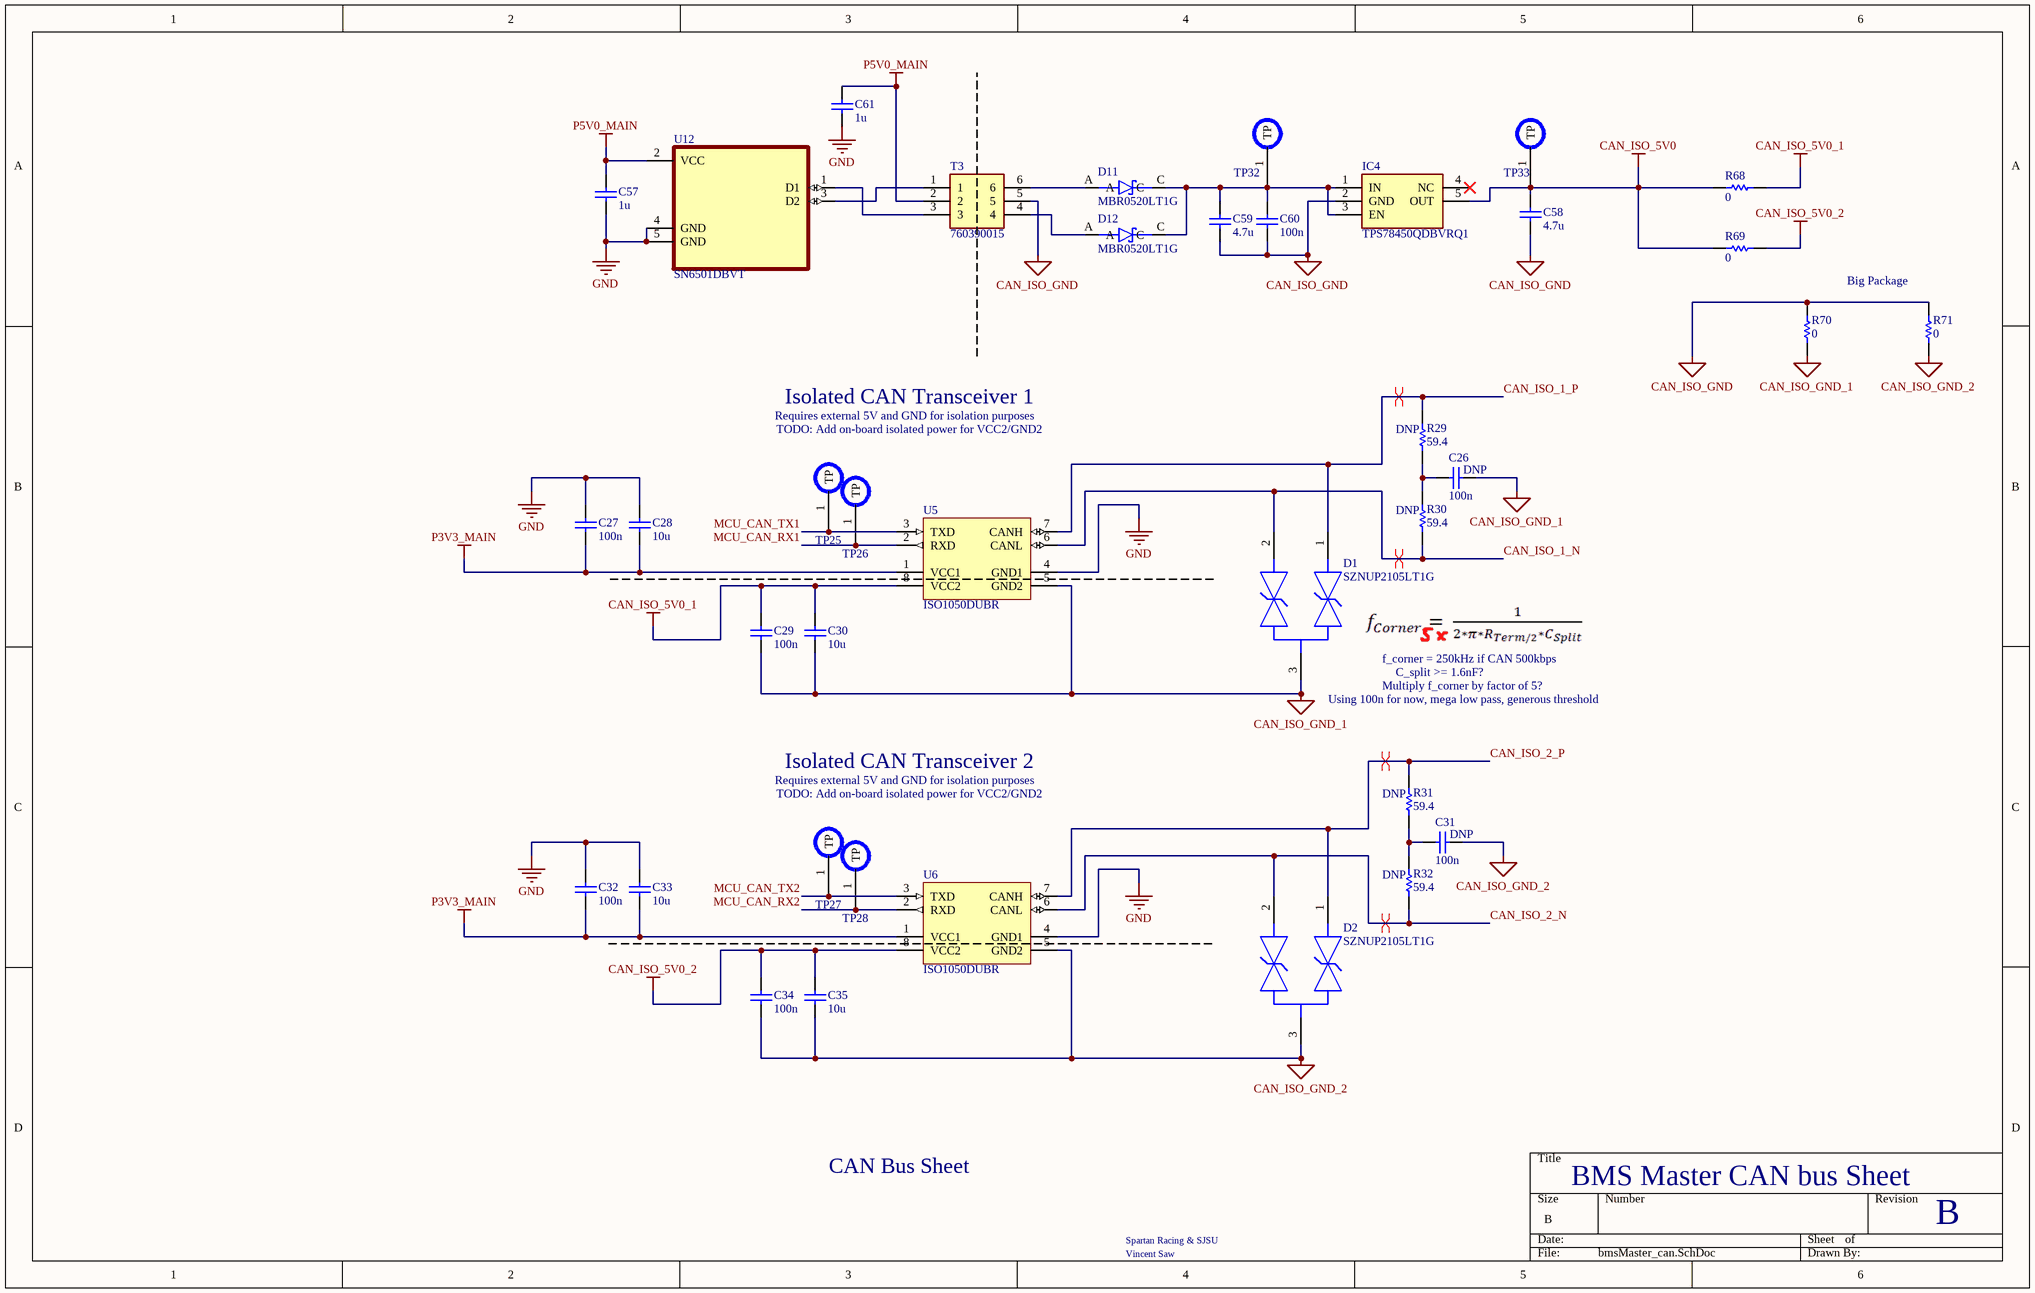
[diagram p7: bmsMaster_can.SchDoc]

### Parts
C26  value 100n  [CAPC1608X90N]  (hidden comment: Capacitor)
C27  value 100n  [CAPC1608X90N]  (hidden comment: Capacitor)
C28  value 10u  [CAPC1608X90N]  (hidden comment: Capacitor)
C29  value 100n  [CAPC1608X90N]  (hidden comment: Capacitor)
C30  value 10u  [CAPC1608X90N]  (hidden comment: Capacitor)
C31  value 100n  [CAPC1608X90N]  (hidden comment: Capacitor)
C32  value 100n  [CAPC1608X90N]  (hidden comment: Capacitor)
C33  value 10u  [CAPC1608X90N]  (hidden comment: Capacitor)
C34  value 100n  [CAPC1608X90N]  (hidden comment: Capacitor)
C35  value 10u  [CAPC1608X90N]  (hidden comment: Capacitor)
C57  value 1u  [CAPC1608X90N]  (hidden comment: Capacitor)
C58  value 4.7u  [CAPC1608X90N]  (hidden comment: Capacitor)
C59  value 4.7u  [CAPC1608X90N]  (hidden comment: Capacitor)
C60  value 100n  [CAPC1608X90N]  (hidden comment: Capacitor)
C61  value 1u  [CAPC1608X90N]  (hidden comment: Capacitor)
D1  SZNUP2105LT1G  [FP-318-08-MFG]
D2  SZNUP2105LT1G  [FP-318-08-MFG]
D11  MBR0520LT1G  [SOD3716X135N]
D12  MBR0520LT1G  [SOD3716X135N]
IC4  TPS78450QDBVRQ1  [SOT95P280X145-5N]
R29  value 59.4  [RESC1608X50N]  (hidden comment: Resistor)
R30  value 59.4  [RESC1608X50N]  (hidden comment: Resistor)
R31  value 59.4  [RESC1608X50N]  (hidden comment: Resistor)
R32  value 59.4  [RESC1608X50N]  (hidden comment: Resistor)
R68  value 0  [RESC1608X50N]  (hidden comment: Resistor)
R69  value 0  [RESC1608X50N]  (hidden comment: Resistor)
R70  value 0  [RESC1608X50N]  (hidden comment: Resistor)
R71  value 0  [RESC1608X50N]  (hidden comment: Resistor)
T3  760390015  [760390015]
TP25  TSTPT  [Testpoint1]  (value not drawn)  (no BOM)
TP26  TSTPT  [Testpoint1]  (value not drawn)  (no BOM)
TP27  TSTPT  [Testpoint1]  (value not drawn)  (no BOM)
TP28  TSTPT  [Testpoint1]  (value not drawn)  (no BOM)
TP32  TSTPT  [Testpoint1]  (value not drawn)  (no BOM)
TP33  TSTPT  [Testpoint1]  (value not drawn)  (no BOM)
U5  ISO1050DUBR  [DUB0008A_L]
U6  ISO1050DUBR  [DUB0008A_L]
U12  SN6501DBVT  [SOT95P280X145-5N]

### Nets
CAN_ISO_5V0: C58.2 IC4.5(OUT) R68.1 R69.1 TP33.1(TP)
CAN_ISO_5V0_1: C29.2 C30.2 R68.2 U5.8(VCC2)
CAN_ISO_5V0_2: C34.2 C35.2 R69.2 U6.8(VCC2)
CAN_ISO_GND: C58.1 C59.1 C60.1 IC4.2(GND) R70.2 R71.2 T3.5
CAN_ISO_GND_1: C26.1 C29.1 C30.1 D1.3 R70.1 U5.5(GND2)
CAN_ISO_GND_2: C31.1 C34.1 C35.1 D2.3 R71.1 U6.5(GND2)
GND: C27.2 C28.2 C32.2 C33.2 C57.1 C61.1 U5.4(GND1) U6.4(GND1) U12.4(GND) U12.5(GND)
P3V3_MAIN: C27.1 C28.1 C32.1 C33.1 U5.1(VCC1) U6.1(VCC1)
P5V0_MAIN: C57.2 C61.2 T3.2 U12.2(VCC)
CAN_ISO_1_N: D1.2 R30.1 U5.6(CANL)
CAN_ISO_1_P: D1.1 R29.2 U5.7(CANH)
CAN_ISO_2_N: D2.2 R32.1 U6.6(CANL)
CAN_ISO_2_P: D2.1 R31.2 U6.7(CANH)
MCU_CAN_RX1: TP26.1(TP) U5.2(RXD)
MCU_CAN_RX2: TP28.1(TP) U6.2(RXD)
MCU_CAN_TX1: TP25.1(TP) U5.3(TXD)
MCU_CAN_TX2: TP27.1(TP) U6.3(TXD)
NetC26_2: C26.2 R29.1 R30.2
NetC31_2: C31.2 R31.1 R32.2
NetC59_2: C59.2 C60.2 D11.C D12.C IC4.1(IN) IC4.3(EN) TP32.1(TP)
NetD11_A: D11.A T3.6
NetD12_A: D12.A T3.4
NetT3_1: T3.1 U12.3(D2)
NetT3_3: T3.3 U12.1(D1)

Not connected (* = marked no-connect by the designer): IC4 4(NC)*

### Layout directives
differential pair: CAN_ISO_1_N, CAN_ISO_1_P, CAN_ISO_2_N, CAN_ISO_2_P

### Notes on the sheet
- Big Package
- Requires external 5V and GND for isolation purposes
- Isolated CAN Transceiver 1
- TODO: Add on-board isolated power for VCC2/GND2
- (near R29) DNP
- (near C26) DNP
- (near R30) DNP
- (near D1) Using 100n for now, mega low pass, generous threshold
- f_corner = 250kHz if CAN 500kbps
- Multiply f_corner by factor of 5?
- C_split >= 1.6nF?
- Isolated CAN Transceiver 2
- (near R31) DNP
- (near C31) DNP
- (near R32) DNP
- CAN Bus Sheet
- Spartan Racing & SJSU
- BMS Master CAN bus Sheet
- B
- Vincent Saw

### Library data of the parts
C26-C35 C57-C61 = Capacitor: SimulationGenericComponent: True
D1 D2 = CMP-1063-00167-2: TVS DIODE 24V 44V SOT23-3; Manufacturer: ON Semiconductor; Capacitance: 30pF; Max Junction Temp: +150°C; Breakdown Voltage: 26.2V; Number Of Channels: 2; Automotive Grade: Grade 0; Standoff Height: 0.01mm; Peak Pulse Current: 8A; Value: 30pF; Direction: Bidirectional; Peak Pulse Power: 350W; Octopart: https://octopart.com/sznup2105lt1g-on+semiconductor-22134626; Reverse Standoff Voltage: 24V; Digikey Description: TVS DIODE 24V 44V SOT23-3; RoHS: TRUE; Manufacturer Part Number: SZNUP2105LT1G; Height: 1.11mm; Automotive: Yes; ComponentLink2URL: https://www.onsemi.com/pub/Collateral/NUP2105L-D.PDF; Device Class L3: unset; Package: 318-08; Lead Free: Yes; Device Class L2: TVS Diodes; Footprint Url: https://www.onsemi.com/pub/Collateral/318-08.PDF; Temperature Range Low: -55°C; Device Class L1: Circuit Protection; Temperature: -55°C to +150°C; Temperature Range High: +150°C; Category: Diode; Clamping Voltage: 44V; ComponentLink2Description: Datasheet
D11 D12 = MBR0520LT1G: as D9 on sheet bmsMaster_hvpath; Package: None; Price: None; Value: *; MP: MBR0520LT1G; Availability: Unavailable
IC4 = TPS78450QDBVRQ1: as IC3 on sheet bmsMaster_hvpath; Datasheet Link: https://www.ti.com/lit/ds/symlink/tps784-q1.pdf?ts=1621597556803&ref_url=https%253A%252F%252Fwww.ti.com%252Fstore%252Fti%252Fen%252Fp%252Fproduct%252F%253Fp%253DTPS78401QDBVRQ1; Height: 1.45mm; Manufacturer_Part_Number: TPS78450QDBVRQ1; Mouser Part Number: 595-TPS78450QDBVRQ1; Mouser Price/Stock: https://www.mouser.co.uk/ProductDetail/Texas-Instruments/TPS78450QDBVRQ1?qs=OlC7AqGiEDlNiKKFTXJdtA%3D%3D
R29-R32 = Resistor: TC1: 0; SimulationGenericComponent: True; TC2: 0
R68-R71 = Resistor: SimulationGenericComponent: True; TC1: 0; TC2: 0
T3 = 760390015: as T2 on sheet bmsMaster_hvpath; Datasheet Link: https://www.we-online.com/components/products/datasheet/760390015.pdf; Manufacturer_Part_Number: 760390015; Mouser Part Number: 710-760390015; Mouser Price/Stock: https://www.mouser.co.uk/ProductDetail/Wurth-Elektronik/760390015?qs=wElim4iM2pjOQCmk%252B8YbFA%3D%3D
TP25-TP28 TP32 TP33 = Testpoint1
U5 U6 = CMP-0315-00093-2: Isolated CAN Transceiver, -55 to 105 degC, 8-pin SOP (DUB), Green (RoHS & no Sb/Br); Manufacturer: Texas Instruments; Rating: Catalog; Isolated: Yes; Drivers Per Package: 1; PackageReference: DUB0008A; PartNumber: ISO1050DUBR; ComponentLink2Description: Package Specification; ComponentLink1Description: Datasheet; Mounting Technology: Surface Mount; ComponentLink1URL: http://www.ti.com/general/docs/lit/getliterature.tsp?genericPartNumber=ISO1050&fileType=pdf; ComponentLink2URL: http://www.ti.com/litv/pdf/mpds247b; Eco-Plan: Green (RoHS & no Sb/Br); PackageDescription: 8-Pin Small Outline Package 2.54 mm Pitch; PackageVersion: revC, May-2006; SubFamily: CAN; DatasheetVersion: SLLS983E
U12 = SN6501DBVT: as U7 on sheet bmsMaster_hvpath; Package: None; Price: None; Value: *; MP: SN6501DBVT; Availability: Unavailable

## Sheet bmsMaster_led.SchDoc
size A; SheetNumber: 9; SheetTotal: 9
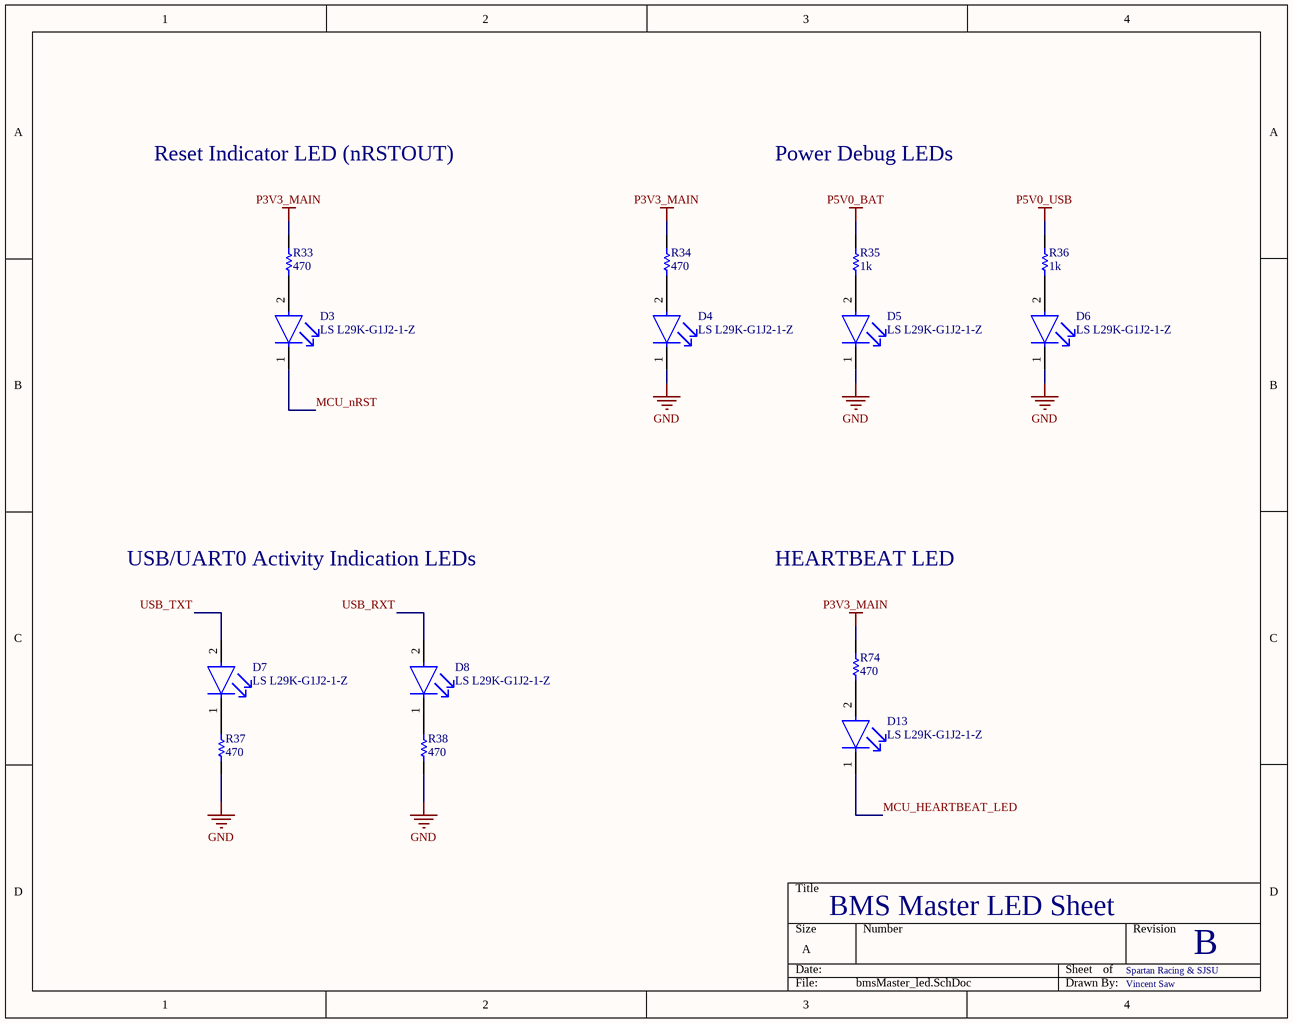
[diagram p8: bmsMaster_led.SchDoc]

### Parts
D3  LS L29K-G1J2-1-Z  [FP-LS_L29K-MFG]
D4  LS L29K-G1J2-1-Z  [FP-LS_L29K-MFG]
D5  LS L29K-G1J2-1-Z  [FP-LS_L29K-MFG]
D6  LS L29K-G1J2-1-Z  [FP-LS_L29K-MFG]
D7  LS L29K-G1J2-1-Z  [FP-LS_L29K-MFG]
D8  LS L29K-G1J2-1-Z  [FP-LS_L29K-MFG]
D13  LS L29K-G1J2-1-Z  [FP-LS_L29K-MFG]
R33  value 470  [RESC1608X50N]  (hidden comment: Resistor)
R34  value 470  [RESC1608X50N]  (hidden comment: Resistor)
R35  value 1k  [RESC1608X50N]  (hidden comment: Resistor)
R36  value 1k  [RESC1608X50N]  (hidden comment: Resistor)
R37  value 470  [RESC1608X50N]  (hidden comment: Resistor)
R38  value 470  [RESC1608X50N]  (hidden comment: Resistor)
R74  value 470  [RESC1608X50N]  (hidden comment: Resistor)

### Nets
GND: D4.1(C) D5.1(C) D6.1(C) R37.1 R38.1
P3V3_MAIN: R33.2 R34.2 R74.2
P5V0_BAT: R35.2
P5V0_USB: R36.2
MCU_HEARTBEAT_LED: D13.1(C)
MCU_nRST: D3.1(C)
USB_RXT: D8.2(A)
USB_TXT: D7.2(A)
NetD3_2: D3.2(A) R33.1
NetD4_2: D4.2(A) R34.1
NetD5_2: D5.2(A) R35.1
NetD6_2: D6.2(A) R36.1
NetD7_1: D7.1(C) R37.2
NetD8_1: D8.1(C) R38.2
NetD13_2: D13.2(A) R74.1

### Notes on the sheet
- Reset Indicator LED (nRSTOUT)
- Power Debug LEDs
- USB/UART0 Activity Indication LEDs
- HEARTBEAT LED
- BMS Master LED Sheet
- Spartan Racing & SJSU
- B
- Vincent Saw

### Library data of the parts
D3-D8 D13 = CMP-62016-000014-1: LED RED DIFFUSED 0603 SMD; Manufacturer: Osram Opto; Luminous Flux: 0.0081/0.0254lm; Forward Voltage: 1.8V; Luminous Intensity: 1.8-2.24/5.6-7.1mcd; Reverse Voltage: 12V; Peak Emmision Wavelength: 643nm; Max Junction Temp: +110°C; Viewing Angle: 160°; Wavelength: 630nm; Forward Current: 2mA; Led Orientation: Top View; Category: Diode; Temperature Range High: +100°C; Automotive: No; Temperature: -40°C to +100°C; Device Class L3: unset; Mouser Description: LED Uni-Color Red 643nm Automotive 2-Pin SMD T/R; Manufacturer Part Number: LS L29K-G1J2-1-Z; ComponentLink2Description: Datasheet; Lead Free: Yes; Device Class L2: LEDs; ComponentLink2URL: https://dammedia.osram.info/media/resource/hires/osram-dam-5662679/LS%20L29K_EN.pdf; Temperature Range Low: -40°C; RoHS: TRUE; Digikey Description: LED RED DIFFUSED 0603 SMD; Colour: Red; Device Class L1: Optoelectronics; Package: LS_L29K; Octopart: https://octopart.com/ls+l29k-g1j2-1-z-osram+opto-31093939; Height: 0.67mm
R33-R38 R74 = Resistor: TC1: 0; SimulationGenericComponent: True; TC2: 0

## Nets that join several sheets
CAN_ISO_5V0_1: bmsMaster_conn (J7.3), bmsMaster_can (C29.2 C30.2 R68.2 U5.8)
CAN_ISO_5V0_2: bmsMaster_conn (J8.3), bmsMaster_can (C34.2 C35.2 R69.2 U6.8)
CAN_ISO_GND_1: bmsMaster_conn (J7.1), bmsMaster_can (6 pins)
CAN_ISO_GND_2: bmsMaster_conn (J8.1), bmsMaster_can (6 pins)
GND: bmsMaster_main (26 pins), bmsMaster_conn (16 pins), bmsMaster_lvpower (7 pins), bmsMaster_hvpath (18 pins), bmsMaster_usb (6 pins), bmsMaster_isospi (10 pins), bmsMaster_can (10 pins), bmsMaster_led (5 pins)
P3V3_MAIN: bmsMaster_main (14 pins), bmsMaster_conn (5 pins), bmsMaster_lvpower (C16.1 R11.1 TP18.1 U3.3), bmsMaster_hvpath (10 pins), bmsMaster_usb (12 pins), bmsMaster_isospi (9 pins), bmsMaster_can (6 pins), bmsMaster_led (R33.2 R34.2 R74.2)
P5V0_BAT: bmsMaster_conn (J3.3), bmsMaster_lvpower (5 pins), bmsMaster_led (R35.2)
P5V0_MAIN: bmsMaster_lvpower (5 pins), bmsMaster_hvpath (C10.2 C62.2 T2.2 U7.2), bmsMaster_can (C57.2 C61.2 T3.2 U12.2)
P5V0_USB: bmsMaster_main (R5.2 R41.2), bmsMaster_conn (J6.1), bmsMaster_lvpower (TP16.1 U2.6), bmsMaster_led (R36.2)
CAN_ISO_1_N: bmsMaster_conn (J7.4), bmsMaster_can (D1.2 R30.1 U5.6)
CAN_ISO_1_P: bmsMaster_conn (J7.2), bmsMaster_can (D1.1 R29.2 U5.7)
CAN_ISO_2_N: bmsMaster_conn (J8.4), bmsMaster_can (D2.2 R32.1 U6.6)
CAN_ISO_2_P: bmsMaster_conn (J8.2), bmsMaster_can (D2.1 R31.2 U6.7)
ISO_xA_N: bmsMaster_conn (J2.2), bmsMaster_isospi (T1.4)
ISO_xA_P: bmsMaster_conn (J2.1), bmsMaster_isospi (T1.6)
MCU_ADC_ISENSE: bmsMaster_main (IC1.24), bmsMaster_hvpath (C52.2 R61.1 TP3.1 U11.4)
MCU_ADC_VSENSE: bmsMaster_main (IC1.25), bmsMaster_hvpath (C42.2 R51.1 TP4.1 U9.4)
MCU_BOOT0: bmsMaster_main (R4.2), bmsMaster_conn (J9.3)
MCU_BOOT1: bmsMaster_main (R44.1), bmsMaster_conn (J9.4)
MCU_CAN_RX1: bmsMaster_main (IC1.61), bmsMaster_can (TP26.1 U5.2)
MCU_CAN_RX2: bmsMaster_main (IC1.33), bmsMaster_can (TP28.1 U6.2)
MCU_CAN_TX1: bmsMaster_main (IC1.62), bmsMaster_can (TP25.1 U5.3)
MCU_CAN_TX2: bmsMaster_main (IC1.34), bmsMaster_can (TP27.1 U6.3)
MCU_GPIO_ADC_PC0: bmsMaster_main (IC1.8 TP5.1), bmsMaster_conn (J10.1)
MCU_GPIO_ADC_PC1: bmsMaster_main (IC1.9 TP6.1), bmsMaster_conn (J10.2)
MCU_GPIO_ADC_PC2: bmsMaster_main (IC1.10 TP11.1), bmsMaster_conn (J10.3)
MCU_GPIO_ADC_PC3: bmsMaster_main (IC1.11 TP12.1), bmsMaster_conn (J10.4)
MCU_HEARTBEAT_LED: bmsMaster_main (IC1.37), bmsMaster_led (D13.1)
MCU_ISO_SPI1_MISO: bmsMaster_main (IC1.22), bmsMaster_isospi (IC2.3 R26.1 TP22.1)
MCU_ISO_SPI1_MOSI: bmsMaster_main (IC1.23), bmsMaster_isospi (IC2.2 TP21.1)
MCU_ISO_SPI1_nCS: bmsMaster_main (IC1.20), bmsMaster_isospi (IC2.5 TP24.1)
MCU_ISO_SPI1_SCK: bmsMaster_main (IC1.21), bmsMaster_isospi (IC2.4 TP23.1)
MCU_JTAG_nTRST: bmsMaster_main (IC1.56), bmsMaster_conn (P1.10)
MCU_JTAG_TCK_SW_CLK: bmsMaster_main (IC1.49), bmsMaster_conn (P1.4)
MCU_JTAG_TDI: bmsMaster_main (IC1.50), bmsMaster_conn (P1.8)
MCU_JTAG_TDO: bmsMaster_main (IC1.55), bmsMaster_conn (P1.6)
MCU_JTAG_TMS_SW_DIO: bmsMaster_main (IC1.46), bmsMaster_conn (P1.2)
MCU_nRST: bmsMaster_main (5 pins), bmsMaster_usb (R16.1), bmsMaster_led (D3.1)
MCU_RXD1: bmsMaster_main (IC1.43), bmsMaster_usb (R15.1 TP20.1 U4.21)
MCU_RXD2: bmsMaster_main (IC1.17), bmsMaster_conn (J4.2)
MCU_RXD3: bmsMaster_main (IC1.30), bmsMaster_conn (J5.2)
MCU_TXD1: bmsMaster_main (R42.2), bmsMaster_usb (R14.1 TP19.1 U4.20)
MCU_TXD2: bmsMaster_main (IC1.16), bmsMaster_conn (J4.4)
MCU_TXD3: bmsMaster_main (IC1.29), bmsMaster_conn (J5.4)
MCU_USB_INT: bmsMaster_main (IC1.14), bmsMaster_usb (R13.1 R17.1)
PMUX_ST: bmsMaster_main (IC1.39 TP10.1), bmsMaster_lvpower (R11.2 U2.8)
USB_D_N: bmsMaster_main (R40.2), bmsMaster_conn (J6.2), bmsMaster_usb (R73.1)
USB_D_P: bmsMaster_main (R5.1 R39.2), bmsMaster_conn (J6.3), bmsMaster_usb (R72.1)
USB_RXT: bmsMaster_usb (U4.13), bmsMaster_led (D8.2)
USB_TXT: bmsMaster_usb (U4.14), bmsMaster_led (D7.2)